# EAGLE schematic moteus_n1 (EAGLE 9.6.0)
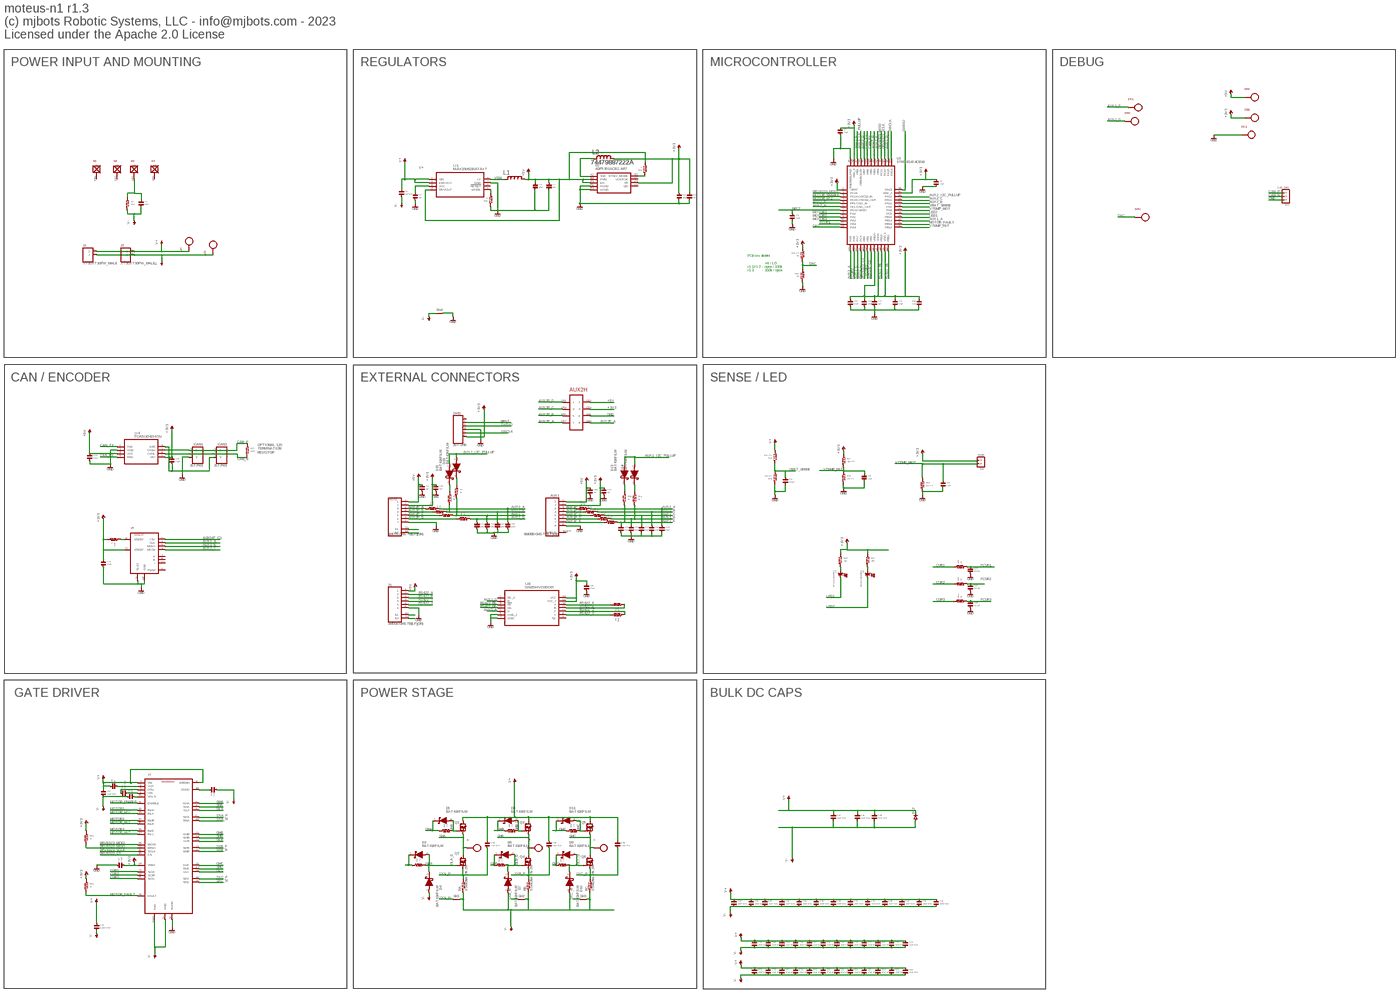
[diagram p0: schematic, sheet 1, overview]
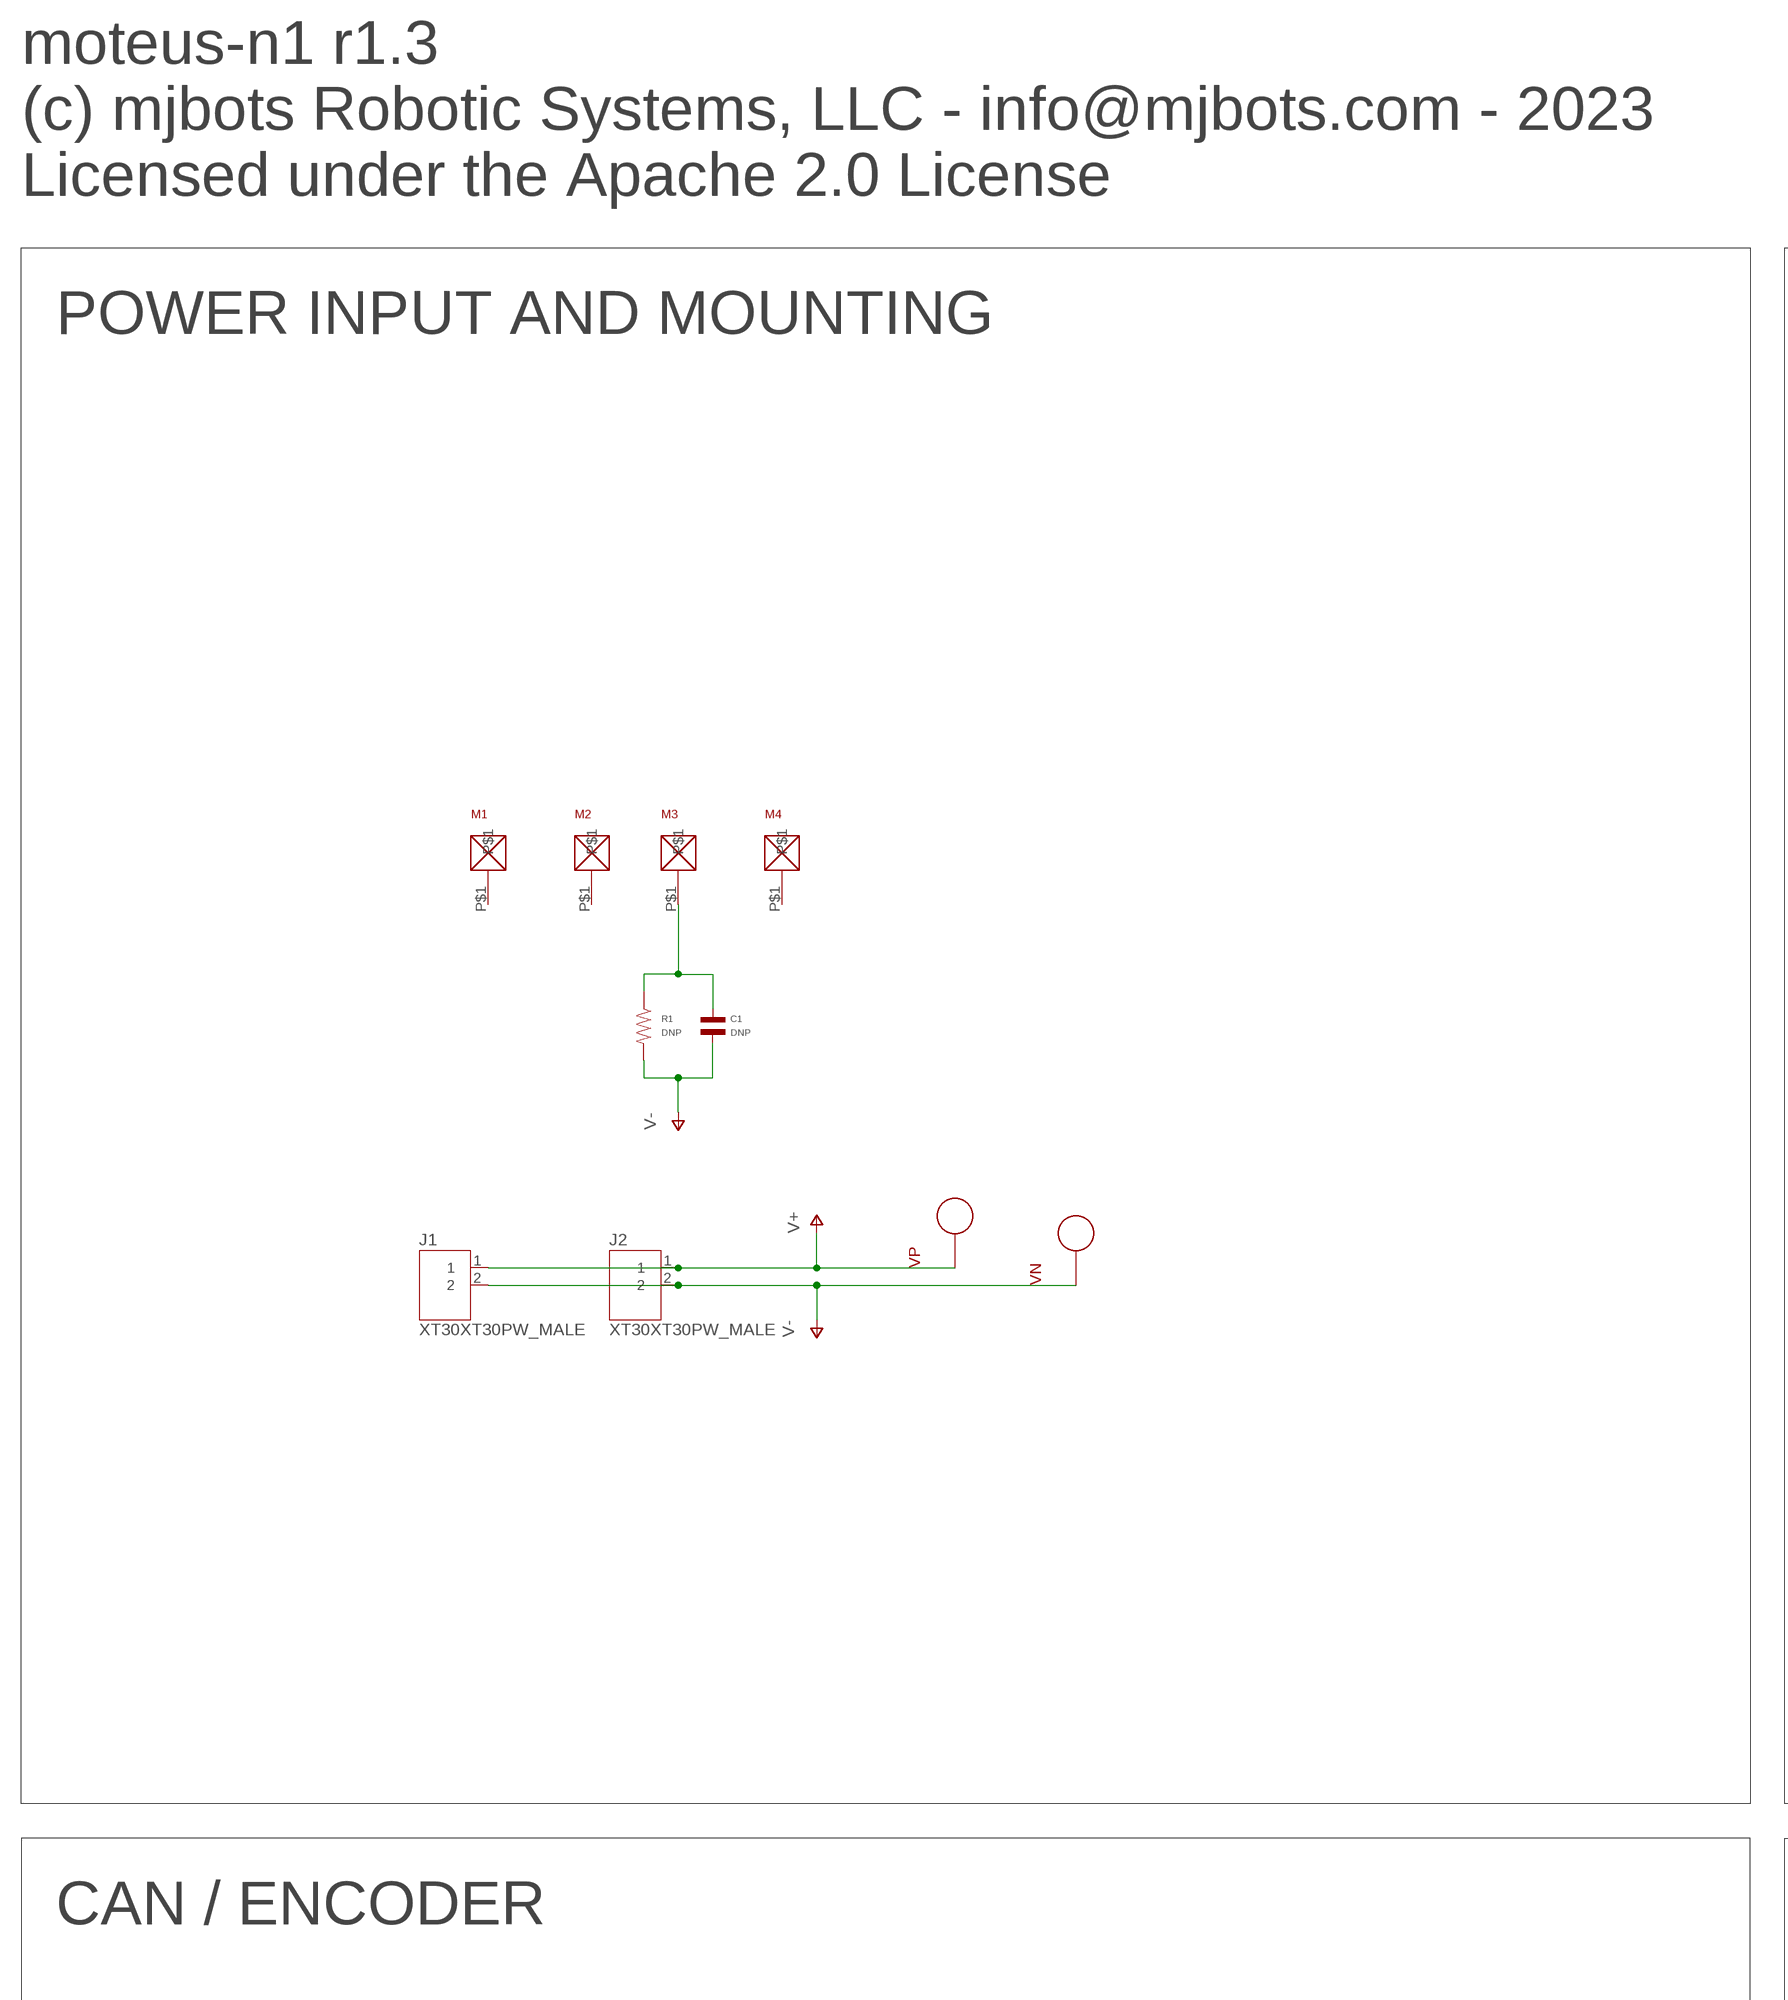
[diagram p1: schematic, sheet 1, part 1 of 7]
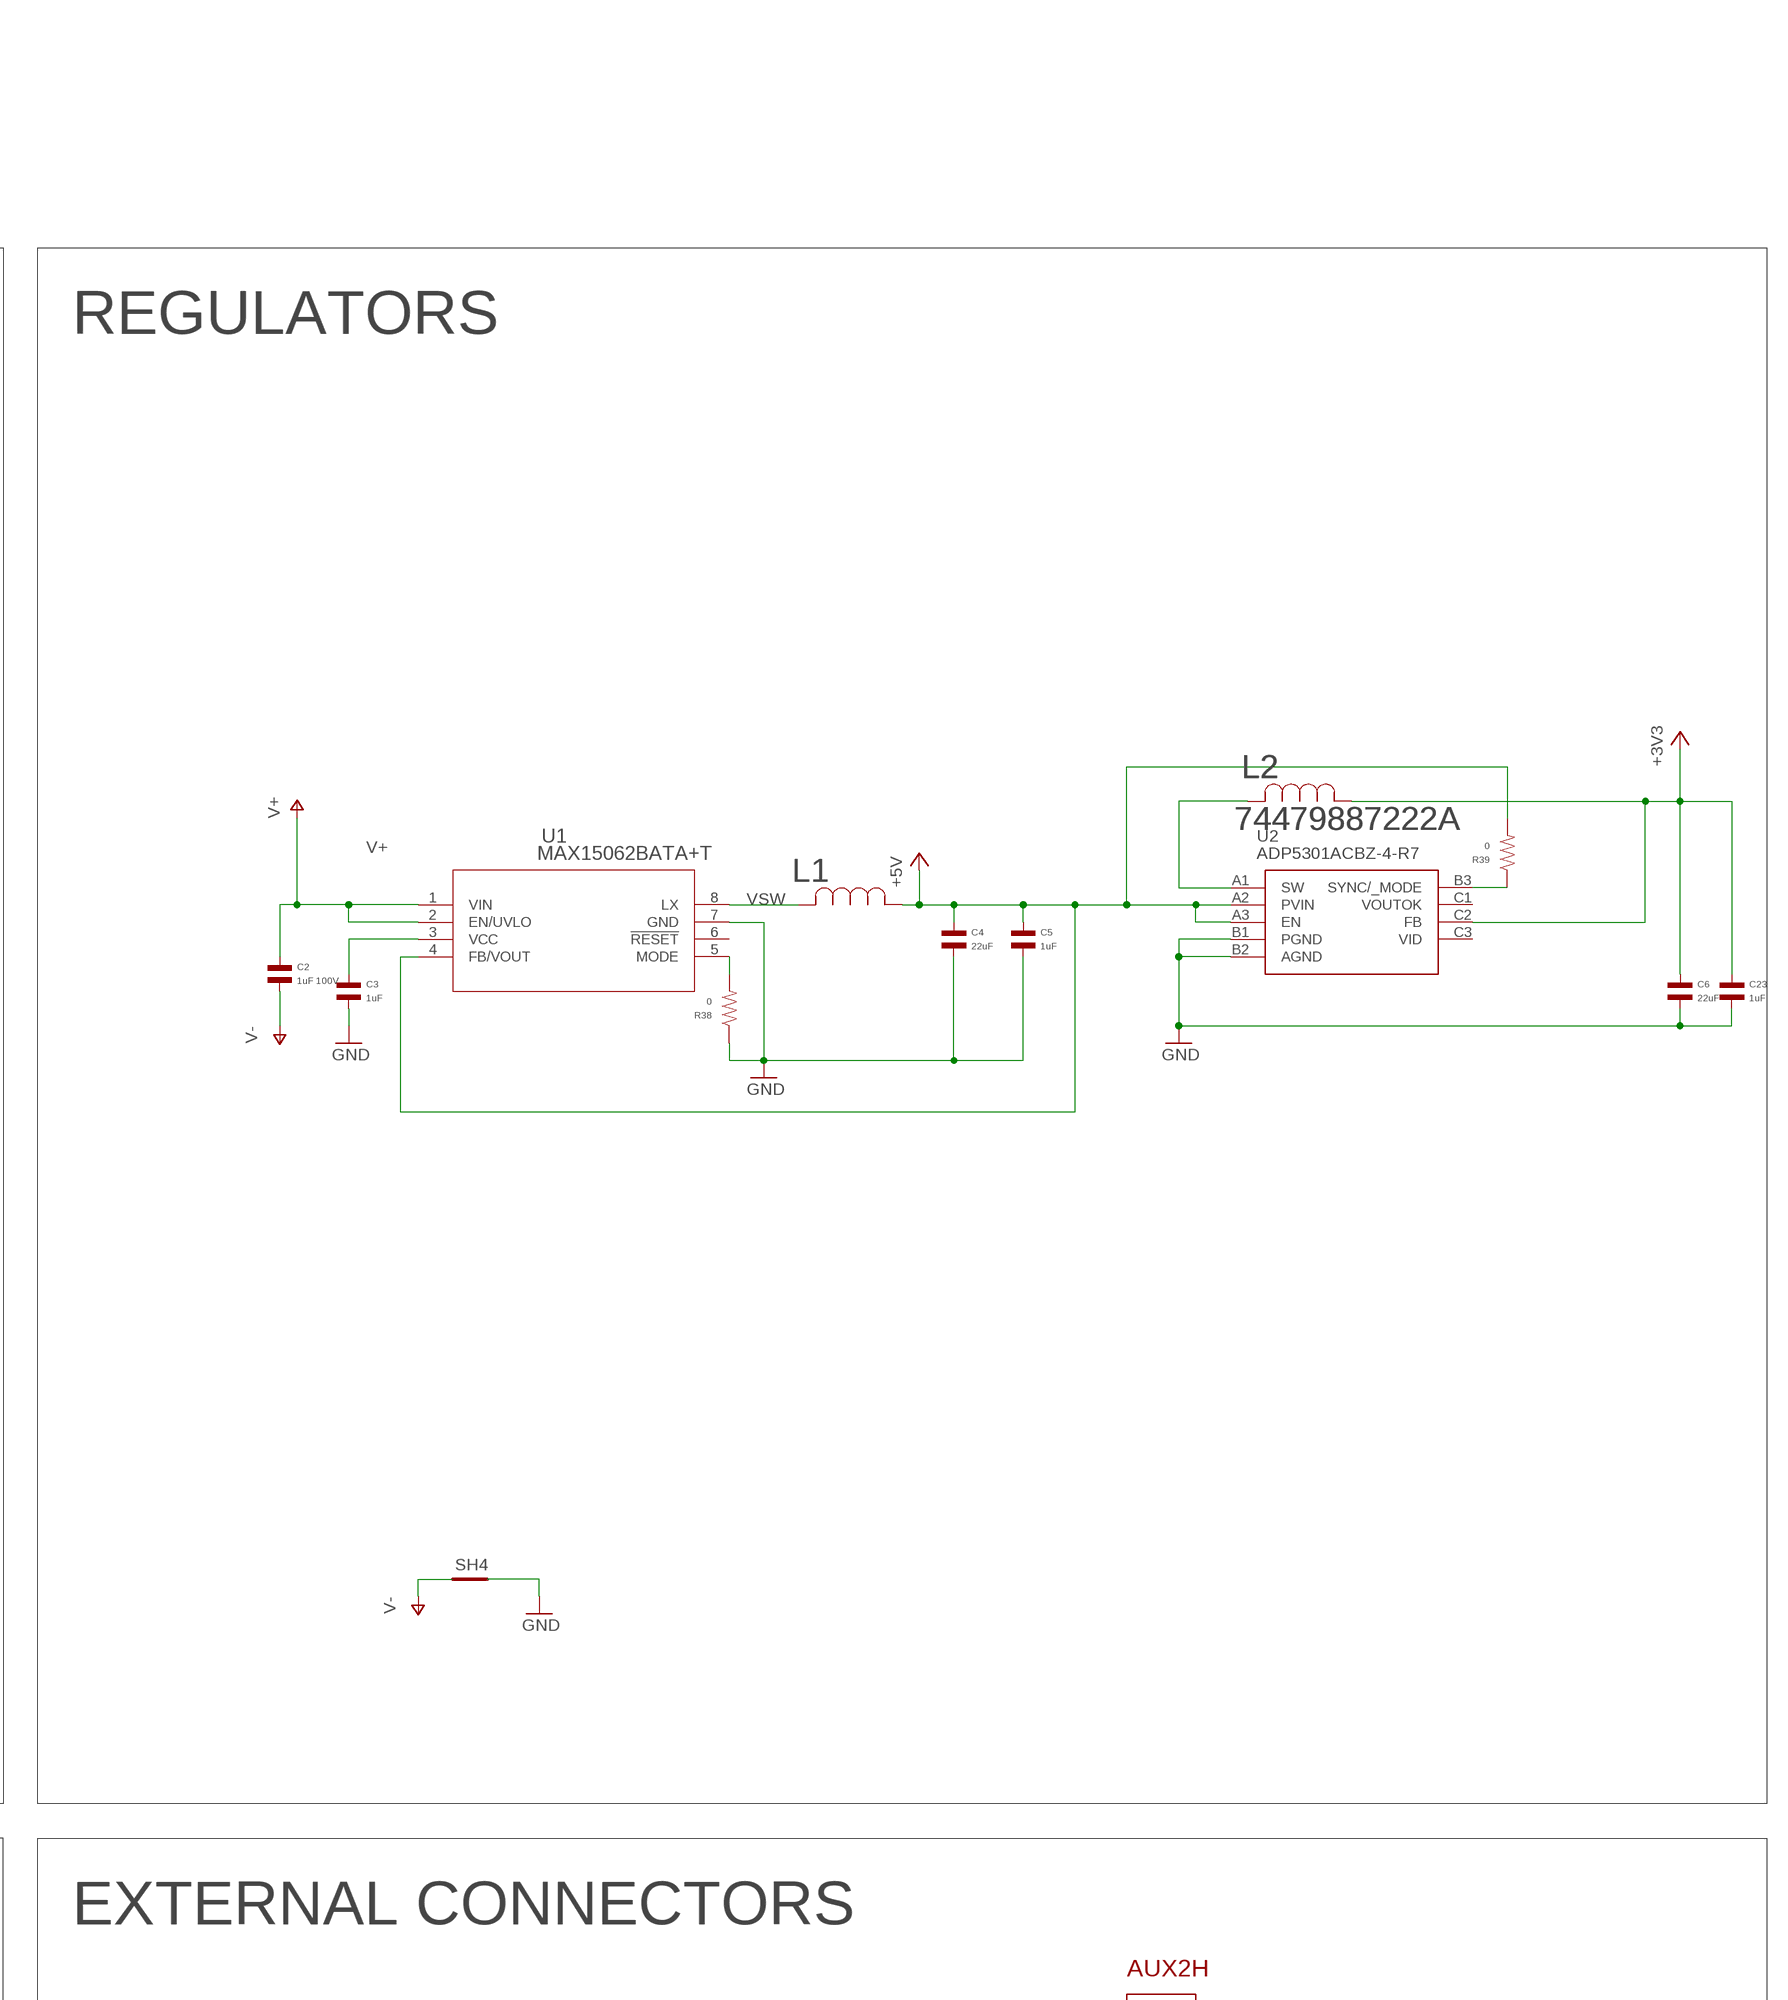
[diagram p2: schematic, sheet 1, part 2 of 7]
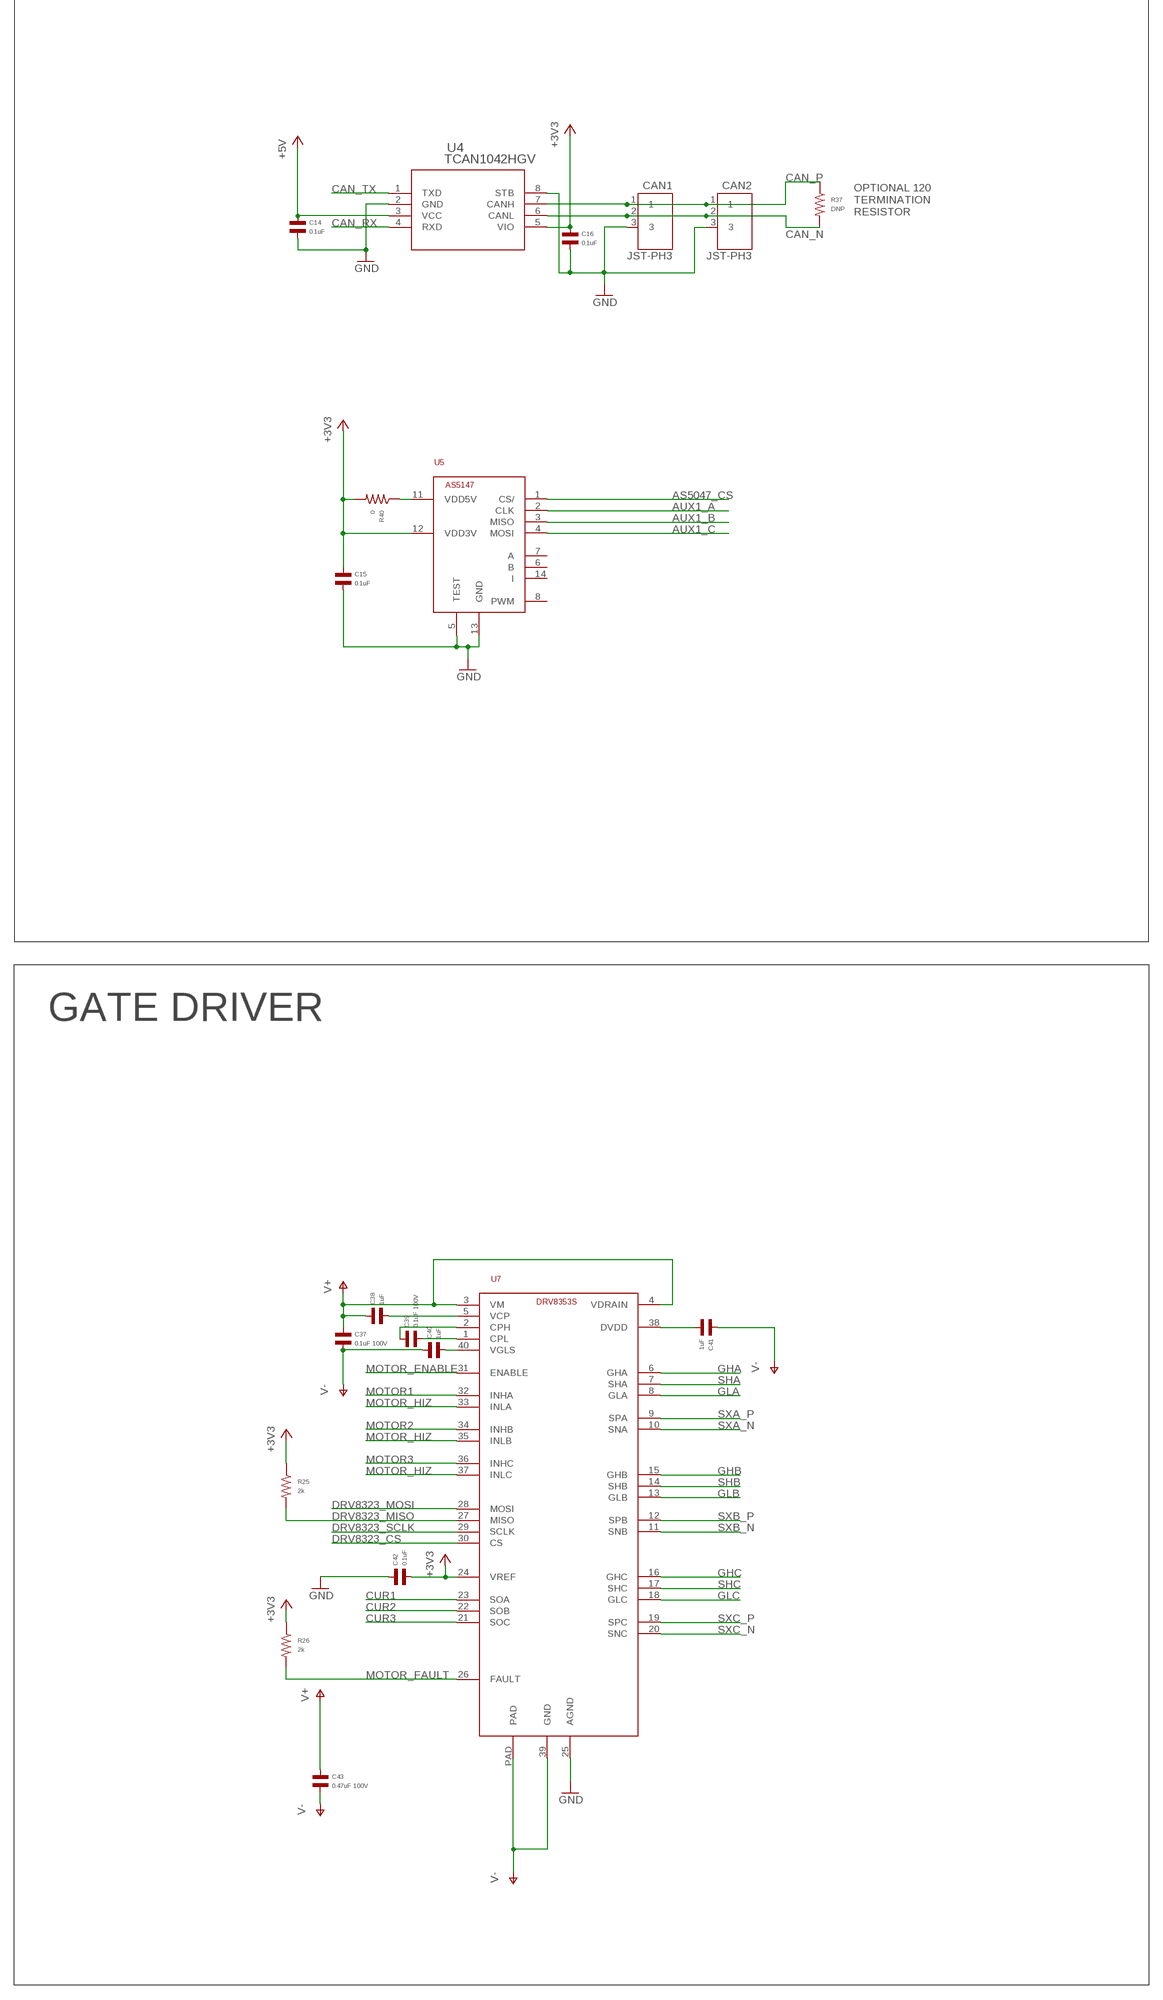
[diagram p3: schematic, sheet 1, part 3 of 7]
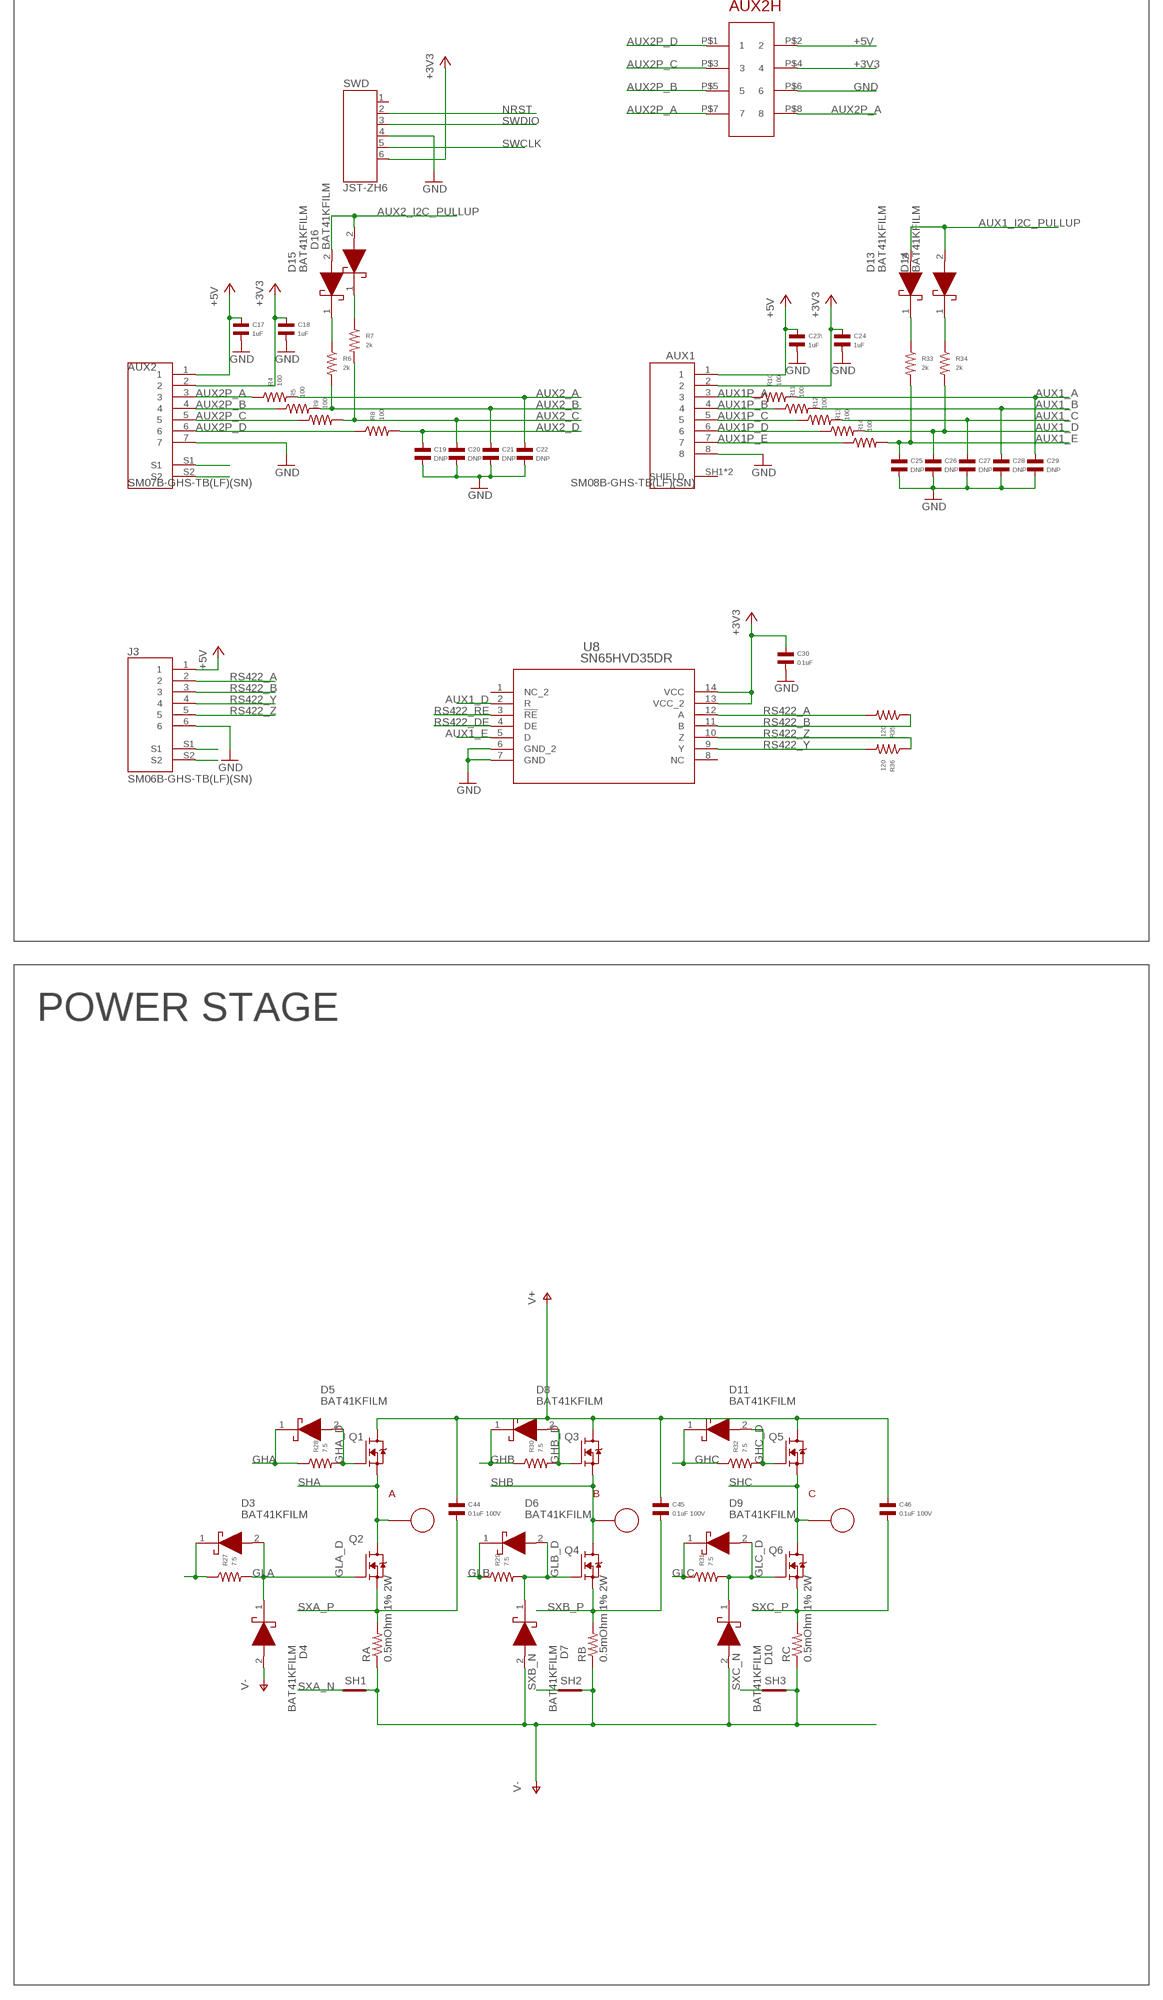
[diagram p4: schematic, sheet 1, part 4 of 7]
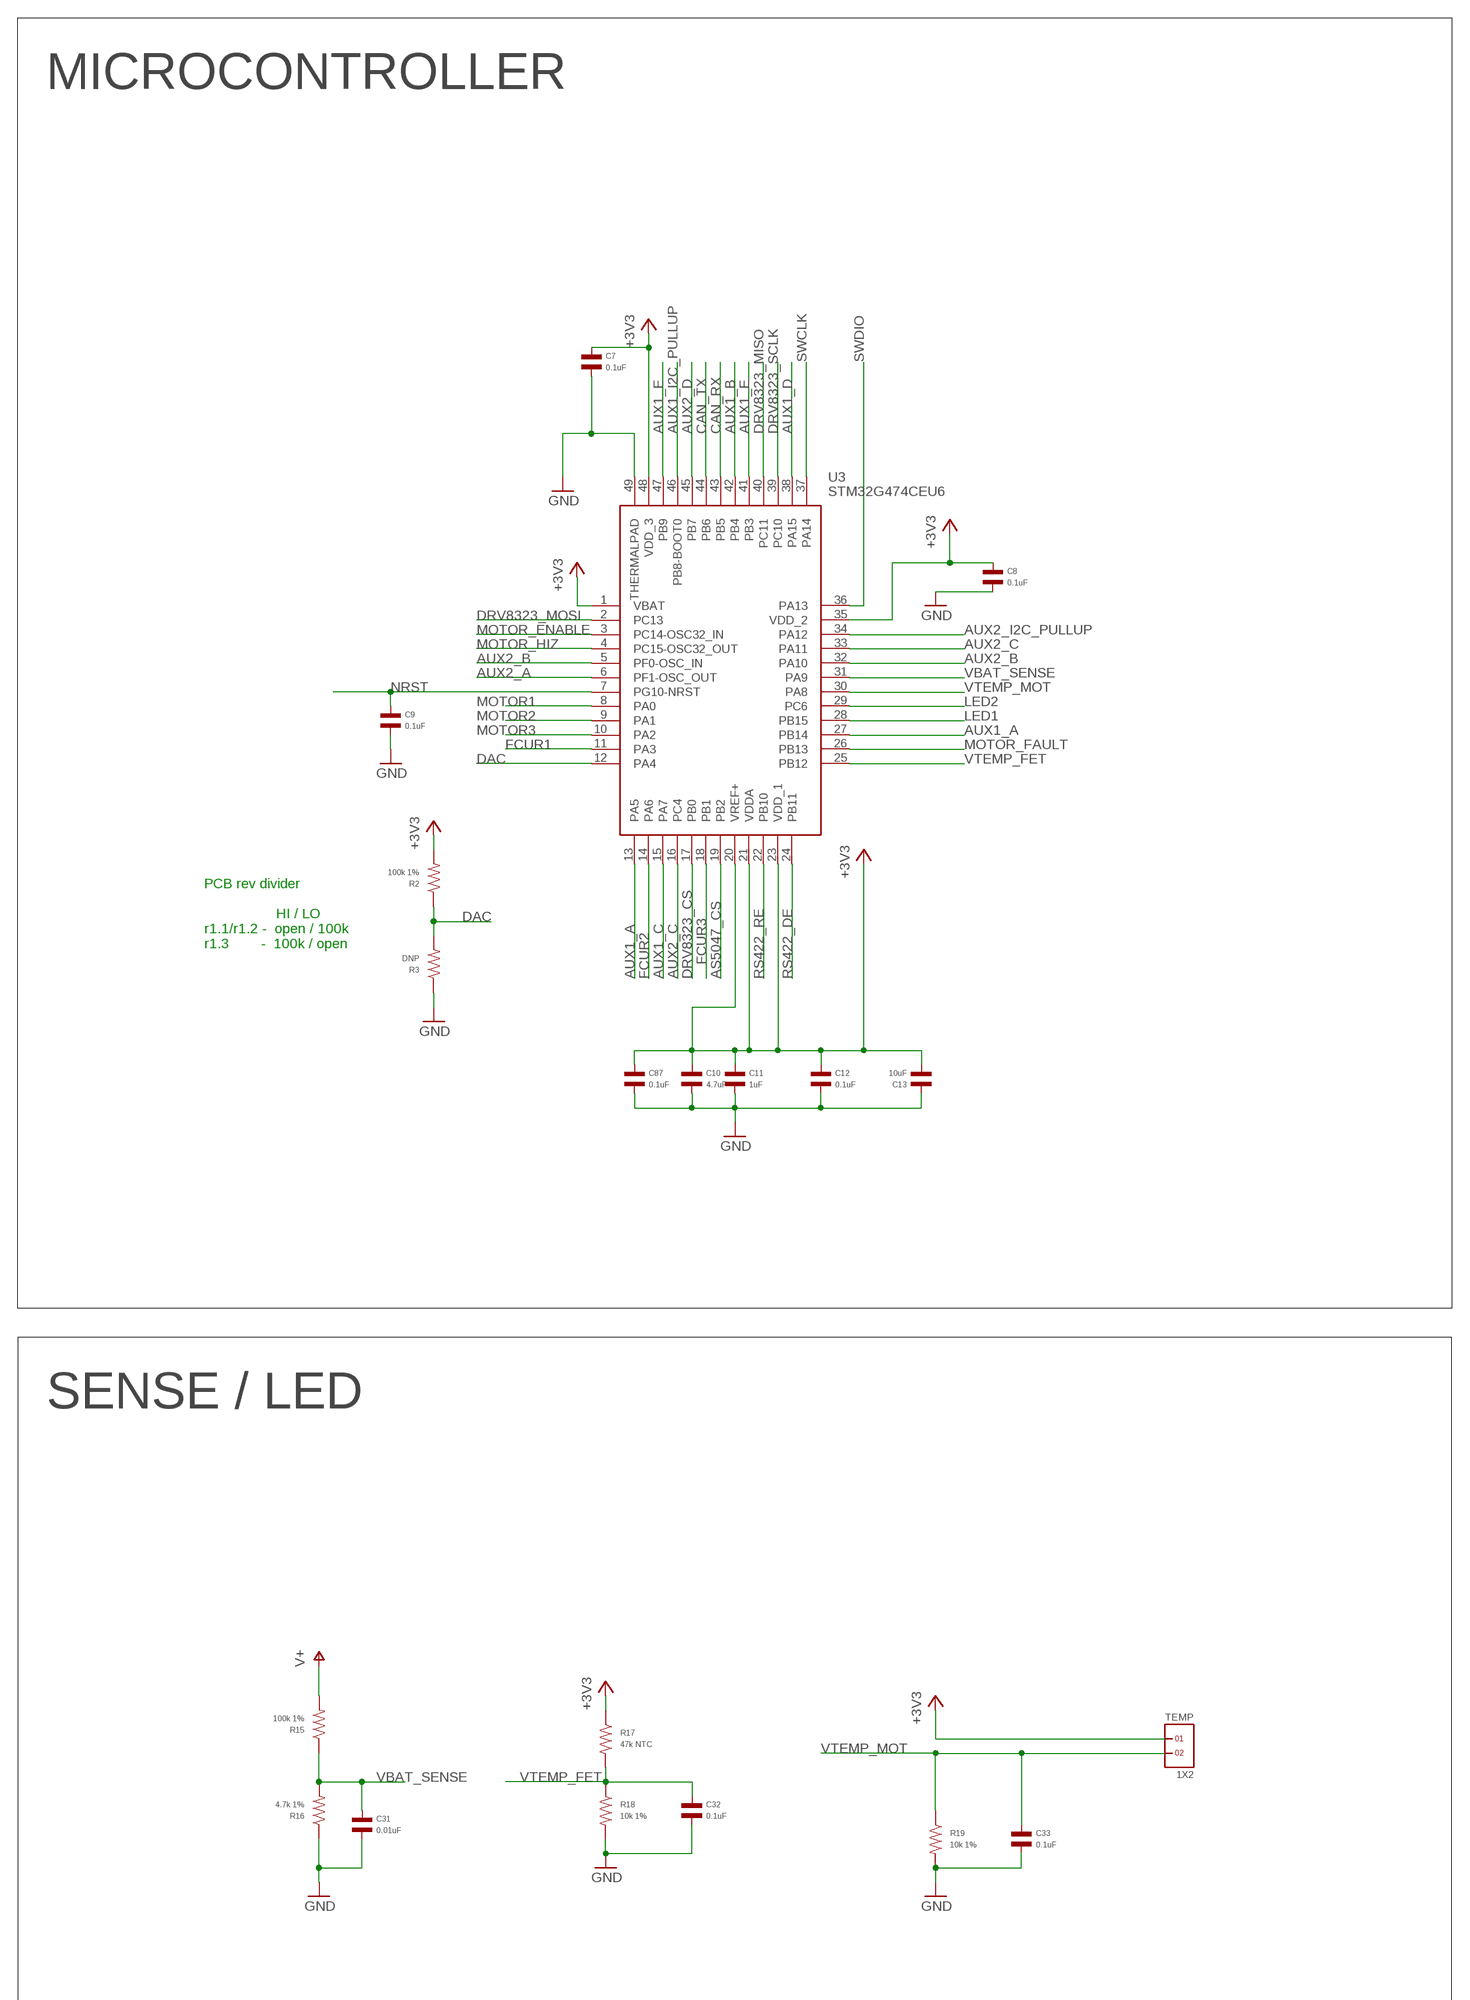
[diagram p5: schematic, sheet 1, part 5 of 7]
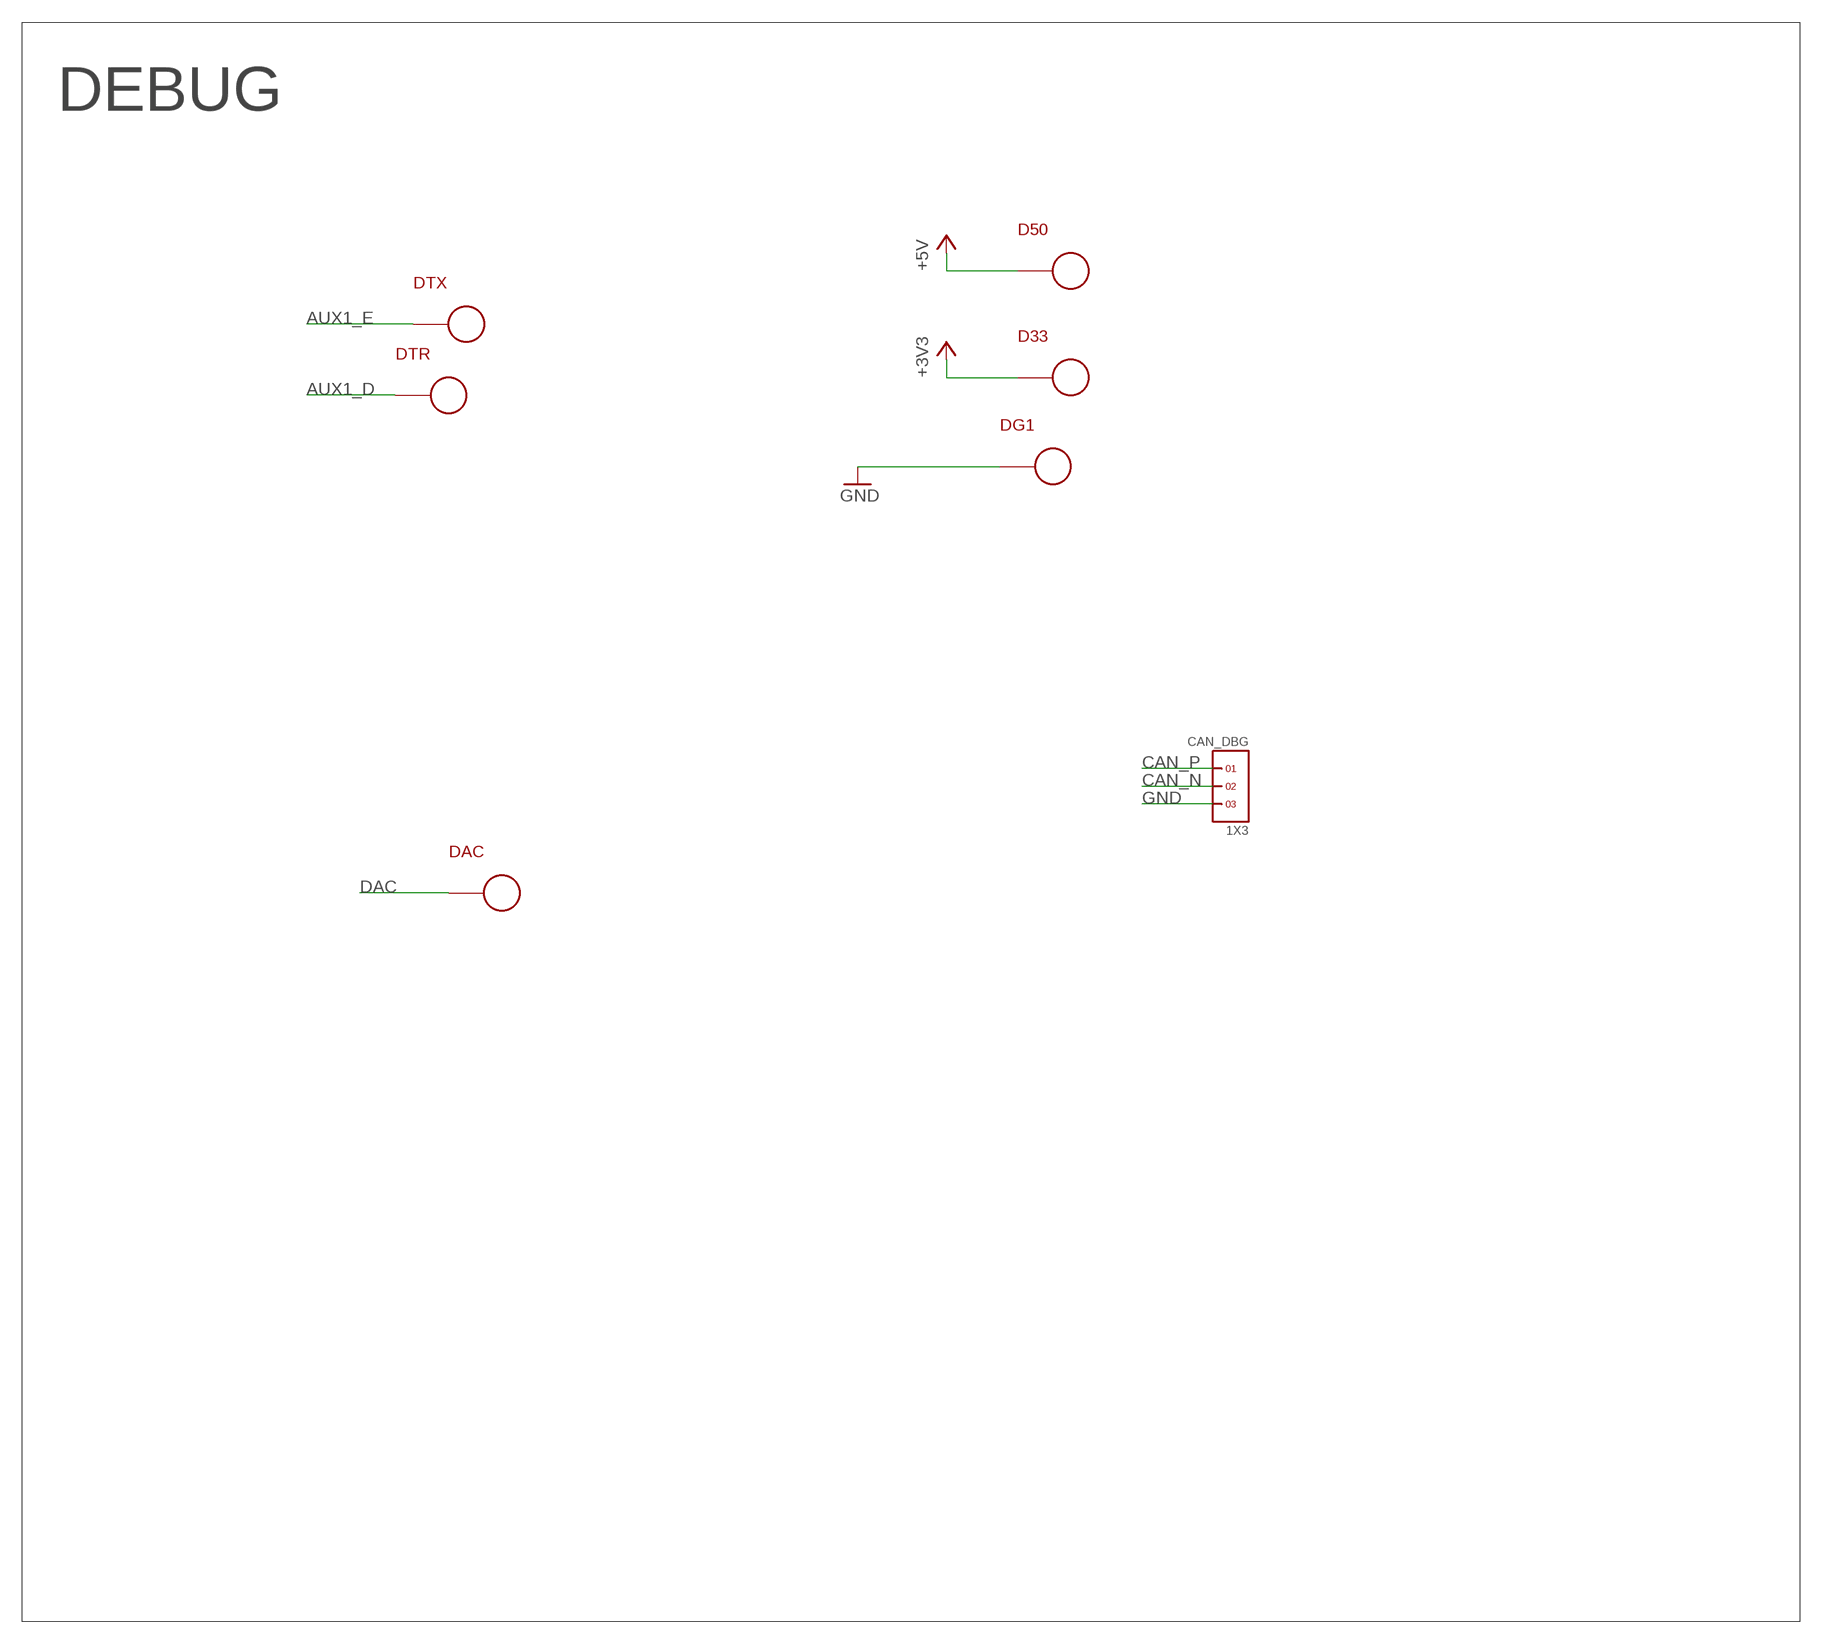
[diagram p6: schematic, sheet 1, part 6 of 7]
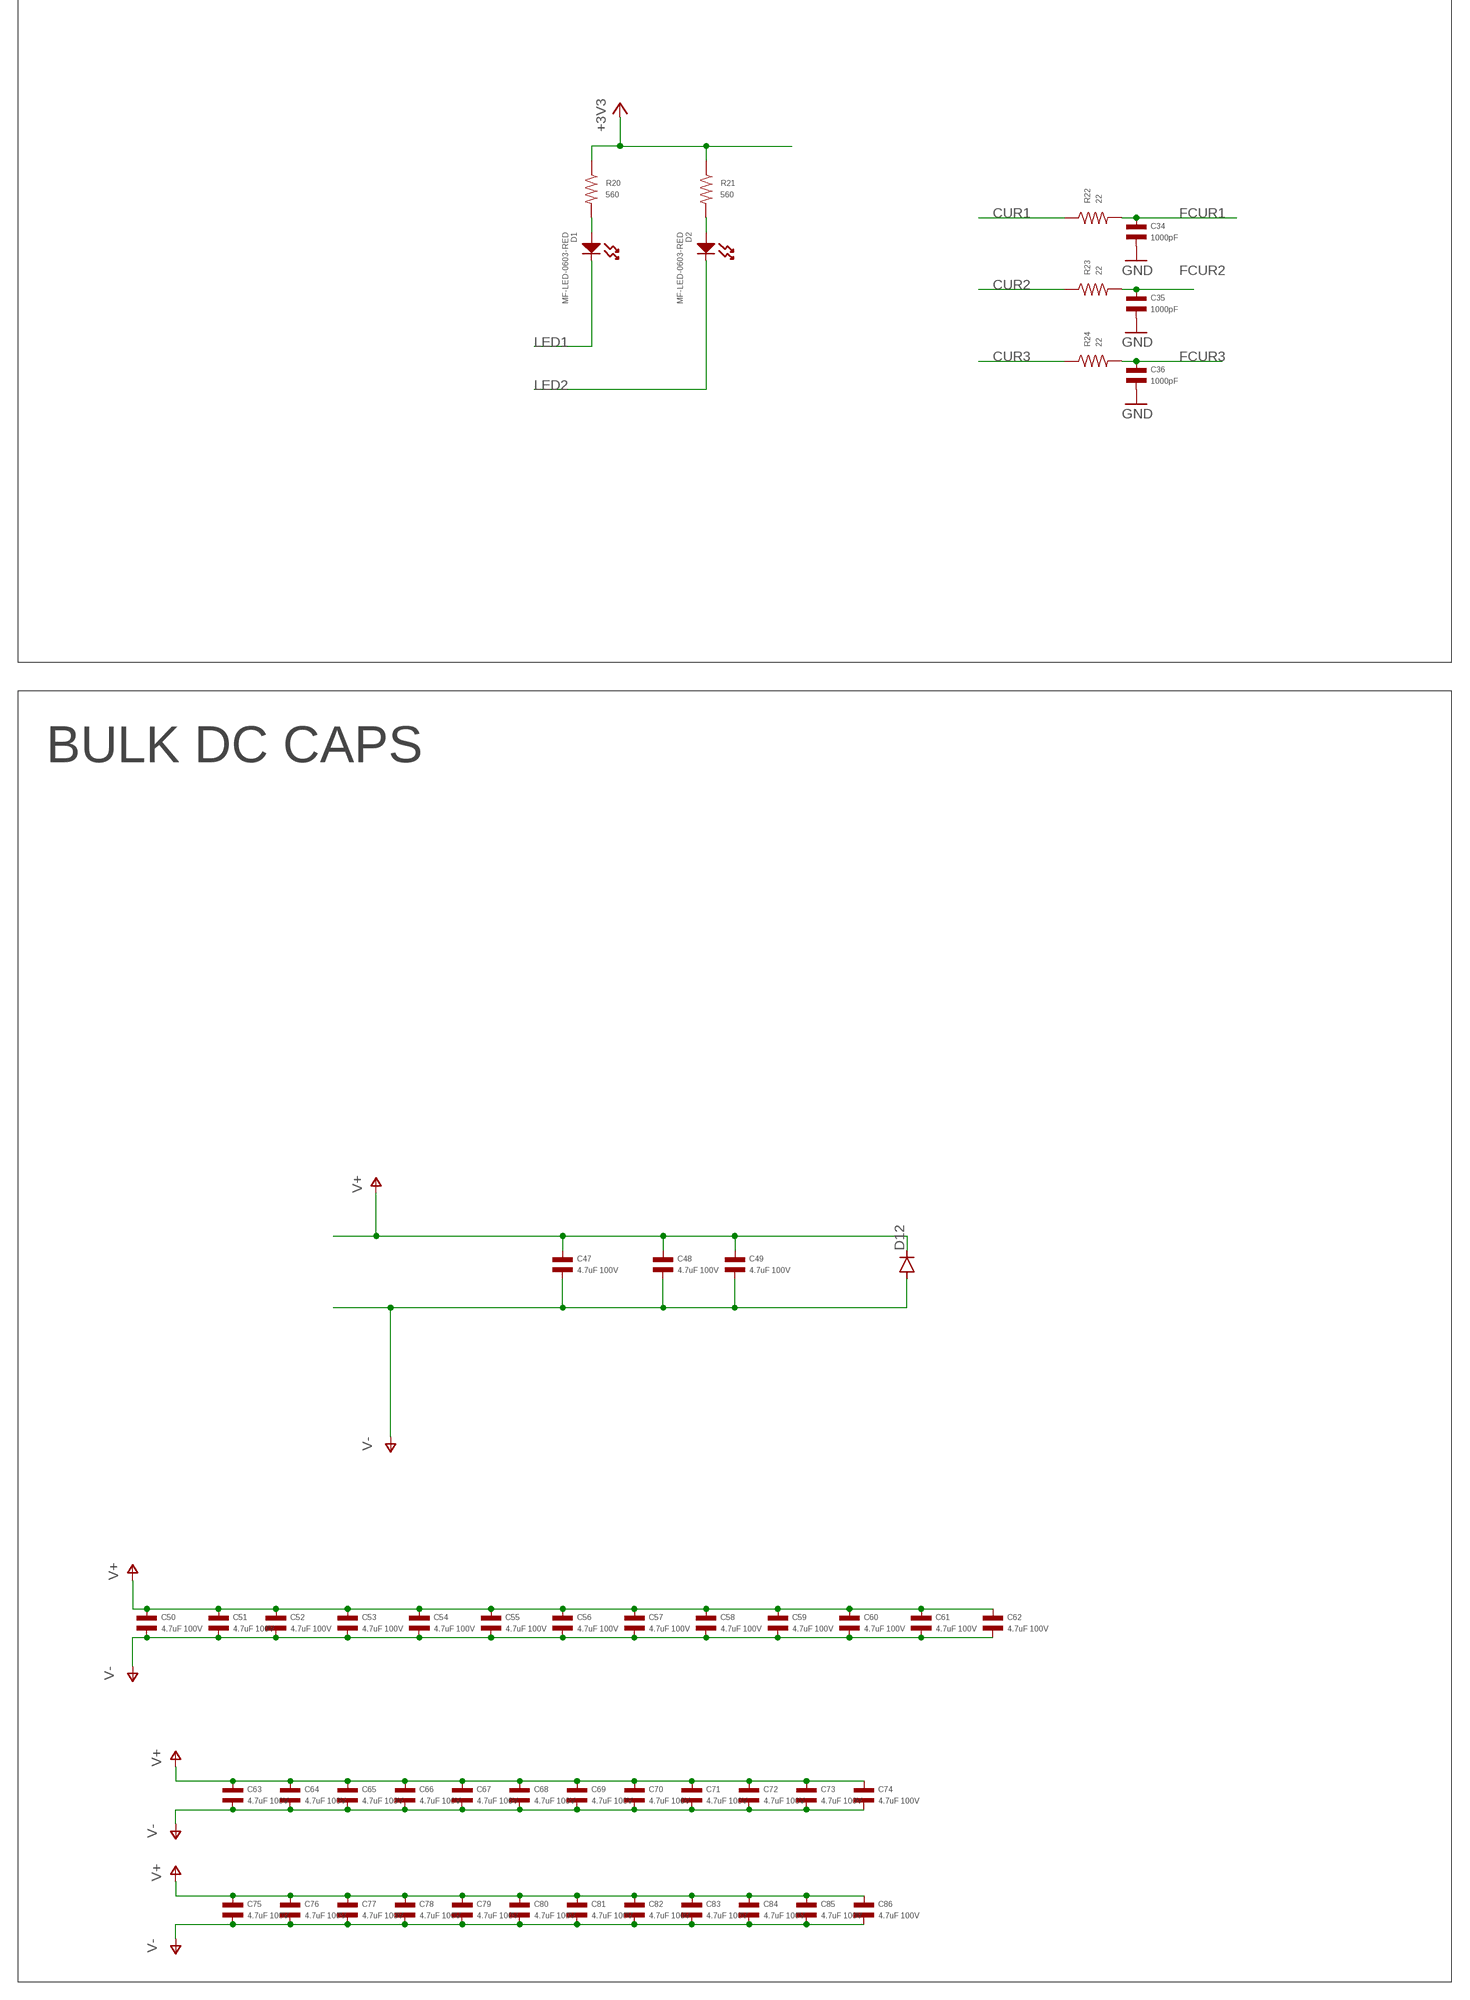
[diagram p7: schematic, sheet 1, part 7 of 7]

## Parts
A  PAD16AWG_TERM  [16AWG_TERM]
AUX1  SM08B-GHS-TB(LF)(SN)  [JST_SM08B-GHS-TB(LF)(SN)]
AUX2  SM07B-GHS-TB(LF)(SN)  [JST_SM07B-GHS-TB(LF)(SN)]
AUX2H  PH2X4  [PH2X4]
B  PAD16AWG_TERM  [16AWG_TERM]
C  PAD16AWG_TERM  [16AWG_TERM]
C1  DNP  CAPACITOR_NP_0402  [C0402]
C2  1uF 100V  CAPACITOR_NP_0805  [C0805]
C3  1uF  CAPACITOR_NP_0603  [C0603]
C4  22uF  CAPACITOR_NP_1206  [C1206]
C5  1uF  CAPACITOR_NP_0402  [C0402]
C6  22uF  CAPACITOR_NP_1206  [C1206]
C7  0.1uF  CAPACITOR_NP_0402  [C0402]
C8  0.1uF  CAPACITOR_NP_0402  [C0402]
C9  0.1uF  CAPACITOR_NP_0402  [C0402]
C10  4.7uF  CAPACITOR_NP_0603  [C0603]
C11  1uF  CAPACITOR_NP_0402  [C0402]
C12  0.1uF  CAPACITOR_NP_0402  [C0402]
C13  10uF  CAPACITOR_NP_1206  [C1206]
C14  0.1uF  CAPACITOR_NP_0402  [C0402]
C15  0.1uF  CAPACITOR_NP_0402  [C0402]
C16  0.1uF  CAPACITOR_NP_0402  [C0402]
C17  1uF  CAPACITOR_NP_0603  [C0603]
C18  1uF  CAPACITOR_NP_0603  [C0603]
C19  DNP  CAPACITOR_NP_0402  [C0402]
C20  DNP  CAPACITOR_NP_0402  [C0402]
C21  DNP  CAPACITOR_NP_0402  [C0402]
C22  DNP  CAPACITOR_NP_0402  [C0402]
C23  1uF  CAPACITOR_NP_0402  [C0402]
C23\  1uF  CAPACITOR_NP_0603  [C0603]
C24  1uF  CAPACITOR_NP_0603  [C0603]
C25  DNP  CAPACITOR_NP_0402  [C0402]
C26  DNP  CAPACITOR_NP_0402  [C0402]
C27  DNP  CAPACITOR_NP_0402  [C0402]
C28  DNP  CAPACITOR_NP_0402  [C0402]
C29  DNP  CAPACITOR_NP_0402  [C0402]
C30  0.1uF  CAPACITOR_NP_0402  [C0402]
C31  0.01uF  CAPACITOR_NP_0402  [C0402]
C32  0.1uF  CAPACITOR_NP_0402  [C0402]
C33  0.1uF  CAPACITOR_NP_0402  [C0402]
C34  1000pF  CAPACITOR_NP_0402  [C0402]
C35  1000pF  CAPACITOR_NP_0402  [C0402]
C36  1000pF  CAPACITOR_NP_0402  [C0402]
C37  0.1uF 100V  CAPACITOR_NP_0603  [C0603]
C38  1uF  CAPACITOR_NP_0603  [C0603]
C39  0.1uF 100V  CAPACITOR_NP_0603  [C0603]
C40  1uF  CAPACITOR_NP_0603  [C0603]
C41  1uF  CAPACITOR_NP_0402  [C0402]
C42  0.1uF  CAPACITOR_NP_0402  [C0402]
C43  0.47uF 100V  CAPACITOR_NP_0805  [C0805]
C44  0.1uF 100V  CAPACITOR_NP_1206  [C1206]
C45  0.1uF 100V  CAPACITOR_NP_1206  [C1206]
C46  0.1uF 100V  CAPACITOR_NP_1206  [C1206]
C47  4.7uF 100V  CAPACITOR_NP_1206  [C1206]
C48  4.7uF 100V  CAPACITOR_NP_1206  [C1206]
C49  4.7uF 100V  CAPACITOR_NP_NOBORDER  [C1206_NOBORDER]
C50  4.7uF 100V  CAPACITOR_NP_NOBORDER  [C1206_NOBORDER]
C51  4.7uF 100V  CAPACITOR_NP_NOBORDER  [C1206_NOBORDER]
C52  4.7uF 100V  CAPACITOR_NP_NOBORDER  [C1206_NOBORDER]
C53  4.7uF 100V  CAPACITOR_NP_NOBORDER  [C1206_NOBORDER]
C54  4.7uF 100V  CAPACITOR_NP_NOBORDER  [C1206_NOBORDER]
C55  4.7uF 100V  CAPACITOR_NP_NOBORDER  [C1206_NOBORDER]
C56  4.7uF 100V  CAPACITOR_NP_NOBORDER  [C1206_NOBORDER]
C57  4.7uF 100V  CAPACITOR_NP_NOBORDER  [C1206_NOBORDER]
C58  4.7uF 100V  CAPACITOR_NP_NOBORDER  [C1206_NOBORDER]
C59  4.7uF 100V  CAPACITOR_NP_NOBORDER  [C1206_NOBORDER]
C60  4.7uF 100V  CAPACITOR_NP_NOBORDER  [C1206_NOBORDER]
C61  4.7uF 100V  CAPACITOR_NP_NOBORDER  [C1206_NOBORDER]
C62  4.7uF 100V  CAPACITOR_NP_NOBORDER  [C1206_NOBORDER]
C63  4.7uF 100V  CAPACITOR_NP_NOBORDER  [C1206_NOBORDER]
C64  4.7uF 100V  CAPACITOR_NP_NOBORDER  [C1206_NOBORDER]
C65  4.7uF 100V  CAPACITOR_NP_NOBORDER  [C1206_NOBORDER]
C66  4.7uF 100V  CAPACITOR_NP_NOBORDER  [C1206_NOBORDER]
C67  4.7uF 100V  CAPACITOR_NP_NOBORDER  [C1206_NOBORDER]
C68  4.7uF 100V  CAPACITOR_NP_NOBORDER  [C1206_NOBORDER]
C69  4.7uF 100V  CAPACITOR_NP_NOBORDER  [C1206_NOBORDER]
C70  4.7uF 100V  CAPACITOR_NP_NOBORDER  [C1206_NOBORDER]
C71  4.7uF 100V  CAPACITOR_NP_NOBORDER  [C1206_NOBORDER]
C72  4.7uF 100V  CAPACITOR_NP_NOBORDER  [C1206_NOBORDER]
C73  4.7uF 100V  CAPACITOR_NP_NOBORDER  [C1206_NOBORDER]
C74  4.7uF 100V  CAPACITOR_NP_NOBORDER  [C1206_NOBORDER]
C75  4.7uF 100V  CAPACITOR_NP_NOBORDER  [C1206_NOBORDER]
C76  4.7uF 100V  CAPACITOR_NP_NOBORDER  [C1206_NOBORDER]
C77  4.7uF 100V  CAPACITOR_NP_NOBORDER  [C1206_NOBORDER]
C78  4.7uF 100V  CAPACITOR_NP_NOBORDER  [C1206_NOBORDER]
C79  4.7uF 100V  CAPACITOR_NP_NOBORDER  [C1206_NOBORDER]
C80  4.7uF 100V  CAPACITOR_NP_NOBORDER  [C1206_NOBORDER]
C81  4.7uF 100V  CAPACITOR_NP_NOBORDER  [C1206_NOBORDER]
C82  4.7uF 100V  CAPACITOR_NP_NOBORDER  [C1206_NOBORDER]
C83  4.7uF 100V  CAPACITOR_NP_NOBORDER  [C1206_NOBORDER]
C84  4.7uF 100V  CAPACITOR_NP_NOBORDER  [C1206_NOBORDER]
C85  4.7uF 100V  CAPACITOR_NP_NOBORDER  [C1206_NOBORDER]
C86  4.7uF 100V  CAPACITOR_NP_NOBORDER  [C1206_NOBORDER]
C87  0.1uF  CAPACITOR_NP_0402  [C0402]
CAN1  JST-PH3  [JST_S3B-PH-SM4-TB(LF)(SN)]
CAN2  JST-PH3  [JST_S3B-PH-SM4-TB(LF)(SN)]
CAN_DBG  1X3  [1X3]
D1  MF-LED-0603-RED  LED_SINGLE-0603-RED  [LED0603]
D2  MF-LED-0603-RED  LED_SINGLE-0603-RED  [LED0603]
D3  BAT41KFILM  [SODFL1608X70N]
D4  BAT41KFILM  [SODFL1608X70N]
D5  BAT41KFILM  [SODFL1608X70N]
D6  BAT41KFILM  [SODFL1608X70N]
D7  BAT41KFILM  [SODFL1608X70N]
D8  BAT41KFILM  [SODFL1608X70N]
D9  BAT41KFILM  [SODFL1608X70N]
D10  BAT41KFILM  [SODFL1608X70N]
D11  BAT41KFILM  [SODFL1608X70N]
D12  DIODE-DO214AA  [DO214AA]
D13  BAT41KFILM  [SODFL1608X70N]
D14  BAT41KFILM  [SODFL1608X70N]
D15  BAT41KFILM  [SODFL1608X70N]
D16  BAT41KFILM  [SODFL1608X70N]
D33  PAD24AWG_PAD  [24AWG_PAD]
D50  PAD24AWG_PAD  [24AWG_PAD]
DAC  PAD24AWG_PAD  [24AWG_PAD]
DG1  PAD24AWG_PAD  [24AWG_PAD]
DTR  PAD24AWG_PAD  [24AWG_PAD]
DTX  PAD24AWG_PAD  [24AWG_PAD]
J1  XT30XT30PW_MALE  [XT30PW_MALE]
J2  XT30XT30PW_MALE  [XT30PW_MALE]
J3  SM06B-GHS-TB(LF)(SN)  [JST_SM06B-GHS-TB(LF)(SN)]
L1  SRN4018-220M  [IND_BOURNS_SRN4018]
L2  74479887222A  [IND_1008_WE-PMI_WRE]
M1  MOUNT  [M2.5MOUNT]
M2  MOUNT  [M2.5MOUNT]
M3  MOUNT  [M2.5MOUNT]
M4  MOUNT  [M2.5MOUNT]
Q1  TPH1R204PL_VIAS  [SOP_ADVANCE_8_VIAS]
Q2  TPH1R204PLSOP_ADVANCE_8  [SOP_ADVANCE_8]
Q3  TPH1R204PL_VIAS  [SOP_ADVANCE_8_VIAS]
Q4  TPH1R204PLSOP_ADVANCE_8  [SOP_ADVANCE_8]
Q5  TPH1R204PL_VIAS  [SOP_ADVANCE_8_VIAS]
Q6  TPH1R204PLSOP_ADVANCE_8  [SOP_ADVANCE_8]
R1  DNP  RESISTOR_0402  [R0402]
R2  100k 1%  RESISTOR_0402  [R0402]
R3  DNP  RESISTOR_0402  [R0402]
R4  100  RESISTOR_0402  [R0402]
R5  100  RESISTOR_0402  [R0402]
R6  2k  RESISTOR_0402  [R0402]
R7  2k  RESISTOR_0402  [R0402]
R8  100  RESISTOR_0402  [R0402]
R9  100  RESISTOR_0402  [R0402]
R10  100  RESISTOR_0402  [R0402]
R11  100  RESISTOR_0402  [R0402]
R12  100  RESISTOR_0402  [R0402]
R13  100  RESISTOR_0402  [R0402]
R14  100  RESISTOR_0402  [R0402]
R15  100k 1%  RESISTOR_0402  [R0402]
R16  4.7k 1%  RESISTOR_0402  [R0402]
R17  47k NTC  RESISTOR_0402  [R0402]
R18  10k 1%  RESISTOR_0402  [R0402]
R19  10k 1%  RESISTOR_0402  [R0402]
R20  560  RESISTOR_0402  [R0402]
R21  560  RESISTOR_0402  [R0402]
R22  22  RESISTOR_0402  [R0402]
R23  22  RESISTOR_0402  [R0402]
R24  22  RESISTOR_0402  [R0402]
R25  2k  RESISTOR_0402  [R0402]
R26  2k  RESISTOR_0402  [R0402]
R27  7.5  RESISTOR_0402  [R0402]
R28  7.5  RESISTOR_0402  [R0402]
R29  7.5  RESISTOR_0805  [R0805]
R30  7.5  RESISTOR_0402  [R0402]
R31  7.5  RESISTOR_0402  [R0402]
R32  7.5  RESISTOR_0402  [R0402]
R33  2k  RESISTOR_0402  [R0402]
R34  2k  RESISTOR_0402  [R0402]
R35  120  RESISTOR_0402  [R0402]
R36  120  RESISTOR_0402  [R0402]
R37  DNP  RESISTOR_0805  [R0805]
R38  0  RESISTOR_0402  [R0402]
R39  0  RESISTOR_0402  [R0402]
R40  0  RESISTOR_0402  [R0402]
RA  0.5mOhm 1% 2W  R-US_M1206  [M1206]
RB  0.5mOhm 1% 2W  R-US_M1206  [M1206]
RC  0.5mOhm 1% 2W  R-US_M1206  [M1206]
SH1  SHORTT5  [SHORT_TOP-50]
SH2  SHORTT5  [SHORT_TOP-50]
SH3  SHORTT5  [SHORT_TOP-50]
SH4  SHORTMEDIUM  [SHORT_TOP-MEDIUM]
SWD  JST-ZH6  [JST_S6B-ZR-SM4A-TF(LF)(SN)]
TEMP  1X2  [1X2]
U1  MAX15062BATA+T  MAX15062AATA+T  [21-0487A_MXM]
U2  ADP5301ACBZ-4-R7  [BGA9C50P3X3_165X187X66]
U3  STM32G474CEU6  [QFN50P700X700X60-49N]
U4  TCAN1042HGV  [SOIC8]
U5  AS5147  [TSSOP14]
U7  DRV8353S  [WQFN-40]
U8  SN65HVD35DR  [D14]
VN  PAD16AWG_TERM  [16AWG_TERM]
VP  PAD16AWG_TERM  [16AWG_TERM]

## Nets
+3V3: AUX1.2 AUX2.2 AUX2H.P$4 C6.P$1 C7.P$1 C8.P$1 C10.P$1 C11.P$1 C12.P$1 C13.P$2 C15.P$1 C16.P$1 C18.P$1 C23.P$1 C24.P$1 C30.P$1 C42.P$2 C87.P$1 D33.P$1 L2.1 R2.P$2 R17.P$1 R20.P$1 R21.P$1 R25.P$1 R26.P$1 R40.P$2 SWD.6 TEMP.1 U2.C2(FB) U3.1(VBAT) U3.20(VREF+) U3.21(VDDA) U3.23(VDD_1) U3.35(VDD_2) U3.48(VDD_3) U4.5(VIO) U5.12(VDD3V) U7.24(VREF) U8.13(VCC_2) U8.14(VCC)
+5V: AUX1.1 AUX2.1 AUX2H.P$2 C4.P$1 C5.P$1 C14.P$1 C17.P$1 C23\.P$1 D50.P$1 J3.1 L1.1 R39.P$2 U1.4(FB/VOUT) U2.A2(PVIN) U2.A3(EN) U4.3(VCC)
AS5047_CS: U3.19(PB2) U5.1(CS/)
AUX1_A: C29.P$1 R10.P$2 U3.13(PA5) U3.27(PB14) U5.2(CLK)
AUX1_B: C28.P$1 R11.P$2 U3.42(PB4) U5.3(MISO)
AUX1_C: C27.P$1 R12.P$2 U3.15(PA7) U5.4(MOSI)
AUX1_D: C26.P$1 DTR.P$1 R13.P$2 R34.P$2 U3.38(PA15) U8.2(R)
AUX1_E: C25.P$1 DTX.P$1 R14.P$2 R33.P$2 U3.41(PB3) U3.47(PB9) U8.5(D)
AUX1_I2C_PULLUP: D13.2(A) D14.2(A) U3.46(PB8-BOOT0)
AUX1P_A: AUX1.3 R10.P$1
AUX1P_B: AUX1.4 R11.P$1
AUX1P_C: AUX1.5 R12.P$1
AUX1P_D: AUX1.6 R13.P$1
AUX1P_E: AUX1.7 R14.P$1
AUX2_A: C22.P$1 R4.P$2 U3.6(PF1-OSC_OUT)
AUX2_B: C21.P$1 R5.P$2 R6.P$2 U3.5(PF0-OSC_IN) U3.32(PA10)
AUX2_C: C20.P$1 R7.P$2 R9.P$2 U3.16(PC4) U3.33(PA11)
AUX2_D: C19.P$1 R8.P$2 U3.45(PB7)
AUX2_I2C_PULLUP: D15.2(A) D16.2(A) U3.34(PA12)
AUX2P_A: AUX2.3 AUX2H.P$7 AUX2H.P$8 R4.P$1
AUX2P_B: AUX2.4 AUX2H.P$5 R5.P$1
AUX2P_C: AUX2.5 AUX2H.P$3 R9.P$1
AUX2P_D: AUX2.6 AUX2H.P$1 R8.P$1
CAN_N [CAN]: CAN1.2 CAN2.2 CAN_DBG.2 R37.P$2 U4.6(CANL)
CAN_P [CAN]: CAN1.1 CAN2.1 CAN_DBG.1 R37.P$1 U4.7(CANH)
CAN_RX: U3.43(PB5) U4.4(RXD)
CAN_TX: U3.44(PB6) U4.1(TXD)
CUR1: R22.P$1 U7.23(SOA)
CUR2: R23.P$1 U7.22(SOB)
CUR3: R24.P$1 U7.21(SOC)
DAC: DAC.P$1 R2.P$1 R3.P$2 U3.12(PA4)
DRV8323_CS: U3.17(PB0) U7.30(CS)
DRV8323_MISO: R25.P$2 U3.40(PC11) U7.27(MISO)
DRV8323_MOSI: U3.2(PC13) U7.28(MOSI)
DRV8323_SCLK: U3.39(PC10) U7.29(SCLK)
FCUR1: C34.P$1 R22.P$2 U3.11(PA3)
FCUR2: C35.P$1 R23.P$2 U3.14(PA6)
FCUR3: C36.P$1 R24.P$2 U3.18(PB1)
GHA [GATE]: D5.1(K) R28.P$1 U7.6(GHA)
GHA_D [GATE]: D5.2(A) Q1.4(G) R28.P$2
GHB [GATE]: D8.1(K) R30.P$1 U7.15(GHB)
GHB_D [GATE]: D8.2(A) Q3.4(G) R30.P$2
GHC [GATE]: D11.1(K) R32.P$1 U7.16(GHC)
GHC_D [GATE]: D11.2(A) Q5.4(G) R32.P$2
GLA [GATE]: D3.1(K) R27.P$1 U7.8(GLA)
GLA_D [GATE]: D3.2(A) D4.1(K) Q2.4(G) R27.P$2
GLB [GATE]: D6.1(K) R29.P$1 U7.13(GLB)
GLB_D [GATE]: D6.2(A) D7.1(K) Q4.4(G) R29.P$2
GLC [GATE]: D9.1(K) R31.P$1 U7.18(GLC)
GLC_D [GATE]: D9.2(A) D10.1(K) Q6.4(G) R31.P$2
GND: AUX1.8 AUX2.7 AUX2H.P$6 C3.P$2 C4.P$2 C5.P$2 C6.P$2 C7.P$2 C8.P$2 C9.P$2 C10.P$2 C11.P$2 C12.P$2 C13.P$1 C14.P$2 C15.P$2 C16.P$2 C17.P$2 C18.P$2 C19.P$2 C20.P$2 C21.P$2 C22.P$2 C23.P$2 C23\.P$2 C24.P$2 C25.P$2 C26.P$2 C27.P$2 C28.P$2 C29.P$2 C30.P$2 C31.P$2 C32.P$2 C33.P$2 C34.P$2 C35.P$2 C36.P$2 C42.P$1 C87.P$2 CAN1.3 CAN2.3 CAN_DBG.3 DG1.P$1 J3.6 R3.P$1 R16.P$1 R18.P$2 R19.P$2 R38.P$1 SH4.2 SWD.4 U1.7(GND) U2.B1(PGND) U2.B2(AGND) U3.49(THERMALPAD) U4.2(GND) U4.8(STB) U5.5(TEST) U5.13(GND) U7.25(AGND) U8.6(GND_2) U8.7(GND)
LED1: D1.CATHODE U3.28(PB15)
LED2: D2.CATHODE U3.29(PC6)
MOTOR1: U3.8(PA0) U7.32(INHA)
MOTOR2: U3.9(PA1) U7.34(INHB)
MOTOR3: U3.10(PA2) U7.36(INHC)
MOTOR_ENABLE: U3.3(PC14-OSC32_IN) U7.31(ENABLE)
MOTOR_FAULT: R26.P$2 U3.26(PB13) U7.26(FAULT)
MOTOR_HIZ: U3.4(PC15-OSC32_OUT) U7.33(INLA) U7.35(INLB) U7.37(INLC)
N$1: C1.P$1 M3.P$1 R1.P$1
N$2: C40.P$2 U7.40(VGLS)
N$3: R40.P$1 U5.11(VDD5V)
N$4: C3.P$1 U1.3(VCC)
N$5: L2.2 U2.A1(SW)
N$10: C39.P$2 U7.1(CPL)
N$13: C39.P$1 U7.2(CPH)
N$14: C38.P$2 U7.5(VCP)
N$16: C41.P$2 U7.38(DVDD)
N$17: D1.ANODE R20.P$2
N$18: D2.ANODE R21.P$2
N$20: AUX2.S1
N$21: AUX2.S2
N$22: J3.S1
N$23: J3.S2
N$24: R38.P$2 U1.5(MODE)
N$25: D14.1(K) R34.P$1
N$26: R39.P$1 U2.B3(SYNC/_MODE)
N$27: D13.1(K) R33.P$1
N$28: D15.1(K) R6.P$1
N$29: D16.1(K) R7.P$1
NRST: C9.P$1 SWD.2 U3.7(PG10-NRST)
RS422_A: J3.2 R35.P$2 U8.12(A)
RS422_B: J3.3 R35.P$1 U8.11(B)
RS422_DE: U3.24(PB11) U8.4(DE)
RS422_RE: U3.22(PB10) U8.3(!RE)
RS422_Y: J3.4 R36.P$2 U8.9(Y)
RS422_Z: J3.5 R36.P$1 U8.10(Z)
SHA [HV]: A.1 A.2 A.3 A.4 A.5 A.6 A.7 A.8 A.9 A.10 A.11 A.12 A.13 Q1.1(S) Q1.2(S) Q1.3(S) Q2.5(D) Q2.6(D) Q2.7(D) Q2.8(D) Q2.PAD(D) U7.7(SHA)
SHB [HV]: B.1 B.2 B.3 B.4 B.5 B.6 B.7 B.8 B.9 B.10 B.11 B.12 B.13 Q3.1(S) Q3.2(S) Q3.3(S) Q4.5(D) Q4.6(D) Q4.7(D) Q4.8(D) Q4.PAD(D) U7.14(SHB)
SHC [HV]: C.1 C.2 C.3 C.4 C.5 C.6 C.7 C.8 C.9 C.10 C.11 C.12 C.13 Q5.1(S) Q5.2(S) Q5.3(S) Q6.5(D) Q6.6(D) Q6.7(D) Q6.8(D) Q6.PAD(D) U7.17(SHC)
SWCLK: SWD.5 U3.37(PA14)
SWDIO: SWD.3 U3.36(PA13)
SXA_N: SH1.1 U7.10(SNA)
SXA_P: C44.P$2 Q2.1(S) Q2.2(S) Q2.3(S) RA.2 U7.9(SPA)
SXB_N: SH2.1 U7.11(SNB)
SXB_P: C45.P$2 Q4.1(S) Q4.2(S) Q4.3(S) RB.2 U7.12(SPB)
SXC_N: SH3.1 U7.20(SNC)
SXC_P: C46.P$2 Q6.1(S) Q6.2(S) Q6.3(S) RC.2 U7.19(SPC)
V+: C2.P$1 C37.P$1 C38.P$1 C43.P$1 C44.P$1 C45.P$1 C46.P$1 C47.P$1 C48.P$1 C49.P$1 C50.P$1 C51.P$1 C52.P$1 C53.P$1 C54.P$1 C55.P$1 C56.P$1 C57.P$1 C58.P$1 C59.P$1 C60.P$1 C61.P$1 C62.P$1 C63.P$1 C64.P$1 C65.P$1 C66.P$1 C67.P$1 C68.P$1 C69.P$1 C70.P$1 C71.P$1 C72.P$1 C73.P$1 C74.P$1 C75.P$1 C76.P$1 C77.P$1 C78.P$1 C79.P$1 C80.P$1 C81.P$1 C82.P$1 C83.P$1 C84.P$1 C85.P$1 C86.P$1 D12.C J1.1 J2.1 Q1.5(D) Q1.6(D) Q1.7(D) Q1.8(D) Q1.PAD(D) Q3.5(D) Q3.6(D) Q3.7(D) Q3.8(D) Q3.PAD(D) Q5.5(D) Q5.6(D) Q5.7(D) Q5.8(D) Q5.PAD(D) R15.P$2 U1.1(VIN) U1.2(EN/UVLO) U7.3(VM) U7.4(VDRAIN) VP.1 VP.2 VP.3 VP.4 VP.5 VP.6 VP.7 VP.8 VP.9 VP.10 VP.11 VP.12 VP.13
V-: C1.P$2 C2.P$2 C37.P$2 C40.P$1 C41.P$1 C43.P$2 C47.P$2 C48.P$2 C49.P$2 C50.P$2 C51.P$2 C52.P$2 C53.P$2 C54.P$2 C55.P$2 C56.P$2 C57.P$2 C58.P$2 C59.P$2 C60.P$2 C61.P$2 C62.P$2 C63.P$2 C64.P$2 C65.P$2 C66.P$2 C67.P$2 C68.P$2 C69.P$2 C70.P$2 C71.P$2 C72.P$2 C73.P$2 C74.P$2 C75.P$2 C76.P$2 C77.P$2 C78.P$2 C79.P$2 C80.P$2 C81.P$2 C82.P$2 C83.P$2 C84.P$2 C85.P$2 C86.P$2 D4.2(A) D7.2(A) D10.2(A) D12.A J1.2 J2.2 R1.P$2 RA.1 RB.1 RC.1 SH1.2 SH2.2 SH3.2 SH4.1 U7.39(GND) U7.PAD VN.1 VN.2 VN.3 VN.4 VN.5 VN.6 VN.7 VN.8 VN.9 VN.10 VN.11 VN.12 VN.13
VBAT_SENSE: C31.P$1 R15.P$1 R16.P$2 U3.31(PA9)
VSW: L1.2 U1.8(LX)
VTEMP_FET: C32.P$1 R17.P$2 R18.P$1 U3.25(PB12)
VTEMP_MOT: C33.P$1 R19.P$1 TEMP.2 U3.30(PA8)
Unconnected: AUX1.SH1(SHIELD) AUX1.SH2(SHIELD) M1.P$1 M2.P$1 M4.P$1 SWD.1 U1.6(!RESET) U2.C1(VOUTOK) U2.C3(VID) U5.6(B) U5.7(A) U5.8(PWM) U5.14(I) U8.1(NC_2) U8.8(NC)

## Notes on the sheet
- moteus-n1 r1.3
  (c) mjbots Robotic Systems, LLC - info@mjbots.com - 2023
  Licensed under the Apache 2.0 License
- POWER INPUT AND MOUNTING | REGULATORS | MICROCONTROLLER | DEBUG
- PCB rev divider
  
                    HI / LO
  r1.1/r1.2 -  open / 100k
  r1.3        -  100k / open
- CAN / ENCODER | EXTERNAL CONNECTORS | SENSE / LED
- OPTIONAL 120
  TERMINATION
  RESISTOR
- GATE DRIVER | POWER STAGE | BULK DC CAPS

## Library data of the parts
A B C VN VP = moteus_n1:PAD; POPULATE: 0
AUX1 = SM08B-GHS-TB_LF__SN_:SM08B-GHS-TB(LF)(SN): GH Series 8 Position 1.25 mm Pitch Side Entry Shrouded Header; DESCRIPTION: Connector Header Surface Mount, Right Angle 8 position 0.049 (1.25mm); DIGI-KEY_PART_NUMBER: 455-1570-2-ND; MF: JST Sales; MP: SM08B-GHS-TB(LF)(SN); MPN: SM08B-GHS-TB(LF)(SN); PACKAGE: None; POPULATE: 1; PURCHASE-URL: https://pricing.snapeda.com/search/part/SM08B-GHS-TB(LF)(SN)/?ref=eda
AUX2 = SM07B-GHS-TB_LF__SN_:SM07B-GHS-TB(LF)(SN): Conn Shrouded Header HDR 7 POS 1.25mm Solder RA SMD Reel; DESCRIPTION: Connector Header Surface Mount, Right Angle 7 position 0.049 (1.25mm); DIGI-KEY_PART_NUMBER: 455-1569-2-ND; MF: JST Sales; MP: SM07B-GHS-TB(LF)(SN); MPN: SM07B-GHS-TB(LF)(SN); PACKAGE: None; POPULATE: 1; PURCHASE-URL: https://pricing.snapeda.com/search/part/SM07B-GHS-TB(LF)(SN)/?ref=eda
AUX2H = moteus_n1:PH2X4; POPULATE: 0
C1 C19-C22 C25-C29 = mfpassives:CAPACITOR_NP: Library: MF_Passives Description: Device for Non-Polarized Capacitors. Manufacture part number (MPN) can be added via Attributes. Check https://factory.macrofab.com/parts for the house parts list.; POPULATE: 0
C2 = mfpassives:CAPACITOR_NP: Library: MF_Passives Description: Device for Non-Polarized Capacitors. Manufacture part number (MPN) can be added via Attributes. Check https://factory.macrofab.com/parts for the house parts list.; MF: MURATA; MPN: GCM21BC72A105KE36L; POPULATE: 1
C3 C17 C18 C23\ C24 = mfpassives:CAPACITOR_NP: Library: MF_Passives Description: Device for Non-Polarized Capacitors. Manufacture part number (MPN) can be added via Attributes. Check https://factory.macrofab.com/parts for the house parts list.; HOUSEPART: 1; MPN: MF-CAP-0603-1uF; POPULATE: 1
C4 = mfpassives:CAPACITOR_NP: Library: MF_Passives Description: Device for Non-Polarized Capacitors. Manufacture part number (MPN) can be added via Attributes. Check https://factory.macrofab.com/parts for the house parts list.; HOUSEPART: 0; MPN: GRM31CR71A226KE15L; POPULATE: 1
C5 C11 C23 C41 = mfpassives:CAPACITOR_NP: Library: MF_Passives Description: Device for Non-Polarized Capacitors. Manufacture part number (MPN) can be added via Attributes. Check https://factory.macrofab.com/parts for the house parts list.; HOUSEPART: 1; MPN: MF-CAP-0402-1uF; POPULATE: 1
C6 = mfpassives:CAPACITOR_NP: Library: MF_Passives Description: Device for Non-Polarized Capacitors. Manufacture part number (MPN) can be added via Attributes. Check https://factory.macrofab.com/parts for the house parts list.; MF: Samsung; MPN: CL31B226KPHNNNE; POPULATE: 1
C7-C9 C12 C14-C16 C30 C32 C33 C42 C87 = mfpassives:CAPACITOR_NP: Library: MF_Passives Description: Device for Non-Polarized Capacitors. Manufacture part number (MPN) can be added via Attributes. Check https://factory.macrofab.com/parts for the house parts list.; HOUSEPART: 1; MPN: MF-CAP-0402-0.1uF; POPULATE: 1
C10 = mfpassives:CAPACITOR_NP: Library: MF_Passives Description: Device for Non-Polarized Capacitors. Manufacture part number (MPN) can be added via Attributes. Check https://factory.macrofab.com/parts for the house parts list.; HOUSEPART: 0; MPN: CL10A475KP8NNNC; POPULATE: 1
C13 = mfpassives:CAPACITOR_NP: Library: MF_Passives Description: Device for Non-Polarized Capacitors. Manufacture part number (MPN) can be added via Attributes. Check https://factory.macrofab.com/parts for the house parts list.; HOUSEPART: 1; MPN: MF-CAP-1206-10uF; POPULATE: 1
C31 = mfpassives:CAPACITOR_NP: Library: MF_Passives Description: Device for Non-Polarized Capacitors. Manufacture part number (MPN) can be added via Attributes. Check https://factory.macrofab.com/parts for the house parts list.; HOUSEPART: 1; MPN: MF-CAP-0402-0.01uF; POPULATE: 1
C34-C36 = mfpassives:CAPACITOR_NP: Library: MF_Passives Description: Device for Non-Polarized Capacitors. Manufacture part number (MPN) can be added via Attributes. Check https://factory.macrofab.com/parts for the house parts list.; HOUSEPART: 1; MPN: MF-CAP-0402-1nF; POPULATE: 1
C37 C39 = mfpassives:CAPACITOR_NP: Library: MF_Passives Description: Device for Non-Polarized Capacitors. Manufacture part number (MPN) can be added via Attributes. Check https://factory.macrofab.com/parts for the house parts list.; MF: MURATA; MPN: GCJ188R72A104KA01D; POPULATE: 1
C38 C40 = mfpassives:CAPACITOR_NP: Library: MF_Passives Description: Device for Non-Polarized Capacitors. Manufacture part number (MPN) can be added via Attributes. Check https://factory.macrofab.com/parts for the house parts list.; HOUSEPART: 0; MF: TDK; MPN: C1608X7R1E105K080AE; POPULATE: 1
C43 = mfpassives:CAPACITOR_NP: Library: MF_Passives Description: Device for Non-Polarized Capacitors. Manufacture part number (MPN) can be added via Attributes. Check https://factory.macrofab.com/parts for the house parts list.; MF: KYOCERA; MPN: 08051C474KAT2A; POPULATE: 1
C44-C46 = mfpassives:CAPACITOR_NP: Library: MF_Passives Description: Device for Non-Polarized Capacitors. Manufacture part number (MPN) can be added via Attributes. Check https://factory.macrofab.com/parts for the house parts list.; MF: KYOCERA AVX; MPN: 12061C104KAT2A; POPULATE: 1
C47 C48 = mfpassives:CAPACITOR_NP: Library: MF_Passives Description: Device for Non-Polarized Capacitors. Manufacture part number (MPN) can be added via Attributes. Check https://factory.macrofab.com/parts for the house parts list.; MF: MURATA; MPN: GRJ31CC72A475KE01K; POPULATE: 1
C49-C86 = moteus_hp:CAPACITOR_NP; MF: MURATA; MPN: GRJ31CC72A475KE01K; POPULATE: 1
CAN1 = moteus_n1:JST-PH3; MF: JST; MPN: S3B-PH-SM4-TB(LF)(SN); POPULATE: 1
CAN2 = moteus_n1:JST-PH3; MF: JST; MPN: S3B-PH-SM4-TB(LF)(SN); POPULATE: 0
CAN_DBG = headers_2mm:1X3; POPULATE: 0
D1 = mfleds:LED_SINGLE: Library: MF_LEDs Description: Device for Single LED Packages. Manufacture part number (MFG#) can be added via Attributes.; HOUSEPART: 1; MPN: MF-LED-0603-RED; POPULATE: 1; URL: https://factory.macrofab.com/part/MF-LED-0603-RED
D2 = mfleds:LED_SINGLE: Library: MF_LEDs Description: Device for Single LED Packages. Manufacture part number (MFG#) can be added via Attributes.; HOUSEPART: 1; MPN: MF-LED-0603-GREEN; POPULATE: 1; URL: https://factory.macrofab.com/part/MF-LED-0603-RED
D3-D11 D13-D16 = BAT41KFILM:BAT41KFILM: STMicroelectronics 100V 200mA, Diode, 2-Pin SOD-523 BAT41KFILM Source: Datasheet <https://www.st.com/resource/en/datasheet/bat41.pdf>; DESCRIPTION: STMicroelectronics 100V 200mA, Diode, 2-Pin SOD-523 BAT41KFILM; HEIGHT: 0.7mm; MANUFACTURER_NAME: STMicroelectronics; MANUFACTURER_PART_NUMBER: BAT41KFILM; MF: ST; MOUSER_PART_NUMBER: 511-BAT41KFILM; MOUSER_PRICE-STOCK: https://www.mouser.co.uk/ProductDetail/STMicroelectronics/BAT41KFILM?qs=jZi1jxfVU94ZzsUNeiIqGg%3D%3D; MPN: BAT41KFILM; POPULATE: 1
D12 = diode:DIODE-: DIODE; MF: VISHAY; MPN: SMBJ51D-M3/I; POPULATE: 1
D33 D50 DAC DG1 DTR DTX = controller:PAD; POPULATE: 0
J1 = moteus_n1:XT30; MPN: XT30PW-M; POPULATE: 1
J2 = moteus_n1:XT30; MPN: XT30PW-M; POPULATE: 0
J3 = SM06B-GHS-TB_LF__SN_:SM06B-GHS-TB(LF)(SN): Conn Shrouded Header HDR 7 POS 1.25mm Solder RA SMD Reel; DESCRIPTION: Connector Header Surface Mount, Right Angle 7 position 0.049 (1.25mm); MF: JST Sales; MP: SM06B-GHS-TB(LF)(SN); MPN: SM06B-GHS-TB(LF)(SN); PACKAGE: None; POPULATE: 1
L1 = controller:SRN4018-220M; MANUFACTURER_PART_NUMBER: 74404042470; MF: Wurth Electronics; MPN: 74404042470; POPULATE: 1; VENDOR: Wurth
L2 = moteus_n1:74479887222A; COPYRIGHT: Copyright (C) 2023 Ultra Librarian. All rights reserved.; DIGI-KEY_PART_NUMBER_1: 732-4513-2-ND; DIGI-KEY_PART_NUMBER_2: 732-4513-1-ND; DIGI-KEY_PART_NUMBER_3: 732-4513-6-ND; MANUFACTURER_PART_NUMBER: 74479887222A; MF: WURTH; MFR_NAME: Wurth Electronics; MPN: 74479887222A
M1-M4 = controller:MOUNT; POPULATE: 0
Q1-Q6 = moteus_n1:TPH1R204PL; MF: Toshiba; MPN: TPH2R408QM,L1Q; POPULATE: 1
R1 R3 R37 = mfpassives:RESISTOR: Library: MF_Passives Description: Device for Resistors. Manufacture part number (MPN), Voltage, Tolerance, and Wattage Rating can be added via Attributes. Check https://factory.macrofab.com/parts for the house parts list.; POPULATE: 0
R2 R15 = mfpassives:RESISTOR: Library: MF_Passives Description: Device for Resistors. Manufacture part number (MPN), Voltage, Tolerance, and Wattage Rating can be added via Attributes. Check https://factory.macrofab.com/parts for the house parts list.; MF: Yageo; MPN: RC0402FR-07100KL; POPULATE: 1
R4 R5 R8-R14 = mfpassives:RESISTOR: Library: MF_Passives Description: Device for Resistors. Manufacture part number (MPN), Voltage, Tolerance, and Wattage Rating can be added via Attributes. Check https://factory.macrofab.com/parts for the house parts list.; HOUSEPART: 1; MPN: MF-RES-0402-100; POPULATE: 1
R6 R7 R25 R26 R33 R34 = mfpassives:RESISTOR: Library: MF_Passives Description: Device for Resistors. Manufacture part number (MPN), Voltage, Tolerance, and Wattage Rating can be added via Attributes. Check https://factory.macrofab.com/parts for the house parts list.; HOUSEPART: 1; MPN: MF-RES-0402-2K; POPULATE: 1
R16 = mfpassives:RESISTOR: Library: MF_Passives Description: Device for Resistors. Manufacture part number (MPN), Voltage, Tolerance, and Wattage Rating can be added via Attributes. Check https://factory.macrofab.com/parts for the house parts list.; MF: Yageo; MPN: RC0402FR-074K7L; POPULATE: 1
R17 = mfpassives:RESISTOR: Library: MF_Passives Description: Device for Resistors. Manufacture part number (MPN), Voltage, Tolerance, and Wattage Rating can be added via Attributes. Check https://factory.macrofab.com/parts for the house parts list.; MF: Murata; MPN: NCP15WB473F03RC; POPULATE: 1
R18 R19 = mfpassives:RESISTOR: Library: MF_Passives Description: Device for Resistors. Manufacture part number (MPN), Voltage, Tolerance, and Wattage Rating can be added via Attributes. Check https://factory.macrofab.com/parts for the house parts list.; MF: Yageo; MPN: RC0402FR-0710KL; POPULATE: 1
R20 R21 = mfpassives:RESISTOR: Library: MF_Passives Description: Device for Resistors. Manufacture part number (MPN), Voltage, Tolerance, and Wattage Rating can be added via Attributes. Check https://factory.macrofab.com/parts for the house parts list.; HOUSEPART: 1; MPN: MF-RES-0402-560; POPULATE: 1
R22-R24 = mfpassives:RESISTOR: Library: MF_Passives Description: Device for Resistors. Manufacture part number (MPN), Voltage, Tolerance, and Wattage Rating can be added via Attributes. Check https://factory.macrofab.com/parts for the house parts list.; HOUSEPART: 1; MPN: MF-RES-0402-22; POPULATE: 1
R27 R28 R30-R32 = mfpassives:RESISTOR: Library: MF_Passives Description: Device for Resistors. Manufacture part number (MPN), Voltage, Tolerance, and Wattage Rating can be added via Attributes. Check https://factory.macrofab.com/parts for the house parts list.; HOUSEPART: 1; MPN: RC0402FR-077R5L; POPULATE: 1
R29 = mfpassives:RESISTOR: Library: MF_Passives Description: Device for Resistors. Manufacture part number (MPN), Voltage, Tolerance, and Wattage Rating can be added via Attributes. Check https://factory.macrofab.com/parts for the house parts list.; MF: Yageo; MPN: RC0805FR-077R5L; POPULATE: 1
R35 R36 = mfpassives:RESISTOR: Library: MF_Passives Description: Device for Resistors. Manufacture part number (MPN), Voltage, Tolerance, and Wattage Rating can be added via Attributes. Check https://factory.macrofab.com/parts for the house parts list.; HOUSEPART: 0; MPN: RC0402FR-07120RL; POPULATE: 1
R38-R40 = mfpassives:RESISTOR: Library: MF_Passives Description: Device for Resistors. Manufacture part number (MPN), Voltage, Tolerance, and Wattage Rating can be added via Attributes. Check https://factory.macrofab.com/parts for the house parts list.; MPN: MF-RES-0402-0; POPULATE: 1
RA RB RC = rcl:R-US_: RESISTOR, American symbol; MF: Stackpole Electronics; MPN: HCS1206FTL500; POPULATE: 1
SH1-SH3 = shorts:SHORT: Short between two nets; BOM: no; POPULATE: 0
SH4 = shorts:SHORT: Short between two nets; POPULATE: 0
SWD = controller:JST-ZH6; MF: JST; MPN: S6B-ZR-SM4A-TF(LF)(SN); POPULATE: 1
TEMP = headers_2mm:1X2; POPULATE: 0
U1 = power_dist:MAX15062AATA+T; BUILT_BY: EMA_Jessica; COPYRIGHT: Copyright (C) 2018 Accelerated Designs. All rights reserved; MANUFACTURER_PART_NUMBER: MAX15062BATA+T; MF: Maxim; MPN: MAX15062BATA+T; POPULATE: 1; REVISION: 1; SOURCELIBRARY: Maxim_DP_2018-06-12; VENDOR: Maxim Integrated Products
U2 = ADP5301ACBZ-4-R7:ADP5301ACBZ-4-R7: Switching Voltage Regulators ULP buck 3.3V w/o OD 2.8ms Source: Datasheet; DESCRIPTION: Switching Voltage Regulators ULP buck 3.3V w/o OD 2.8ms; HEIGHT: 0.66mm; MANUFACTURER_NAME: Analog Devices; MANUFACTURER_PART_NUMBER: ADP5301ACBZ-4-R7; MOUSER_PART_NUMBER: 584-ADP5301ACBZ-4-R7; MOUSER_PRICE-STOCK: https://www.mouser.co.uk/ProductDetail/Analog-Devices/ADP5301ACBZ-4-R7?qs=P1JMDcb91o5nnuK7yeEdIw%3D%3D; MPN: ADP5301ACBZ-4-R7; POPULATE: 1
U3 = controller:STM32G474CEU6: STMICROELECTRONICS - STM32G474CEU6 - MCU, 32BIT, 170MHZ, UFQFPN-48 Source: Datasheet <https://componentsearchengine.com/Datasheets/1/STM32G474CEU6.pdf>; DESCRIPTION: STMICROELECTRONICS - STM32G474CEU6 - MCU, 32BIT, 170MHZ, UFQFPN-48; HEIGHT: 0.6mm; MANUFACTURER_NAME: STMicroelectronics; MANUFACTURER_PART_NUMBER: STM32G474CEU6; MOUSER_PART_NUMBER: 511-STM32G474CEU6; MOUSER_PRICE-STOCK: https://www.mouser.com/Search/Refine.aspx?Keyword=511-STM32G474CEU6; MPN: STM32G474CEU6; POPULATE: 1
U4 = moteus_hp:TCAN1042HGV; MF: TI; MPN: TCAN1057AEVDRQ1; POPULATE: 1
U5 = controller:AS5147; MF: AMS; MPN: AS5047P-ATSM; POPULATE: 1
U7 = moteus_hp:DRV8353S; MF: TI; MPN: DRV8353FSRTAR; POPULATE: 1
U8 = moteus_hp:SN65HVD35DR; COPYRIGHT: Copyright (C) 2022 Ultra Librarian. All rights reserved.; DIGI-KEY_PART_NUMBER_1: 296-18706-1-ND; DIGI-KEY_PART_NUMBER_2: 296-18706-2-ND; DIGI-KEY_PART_NUMBER_3: 296-18706-6-ND; MANUFACTURER_PART_NUMBER: SN65HVD35DR; MFR_NAME: Texas Instruments

## Net classes
0 default: width 0.127 mm
1 CAN: width 0.216 mm, clearance 0.127 mm
2 HV: clearance 0.13 mm
3 GATE: width 0.384 mm